# EAGLE board A20-OLinuXino-Lime2_Rev_C (EAGLE 6.6.0), part 1 of 5
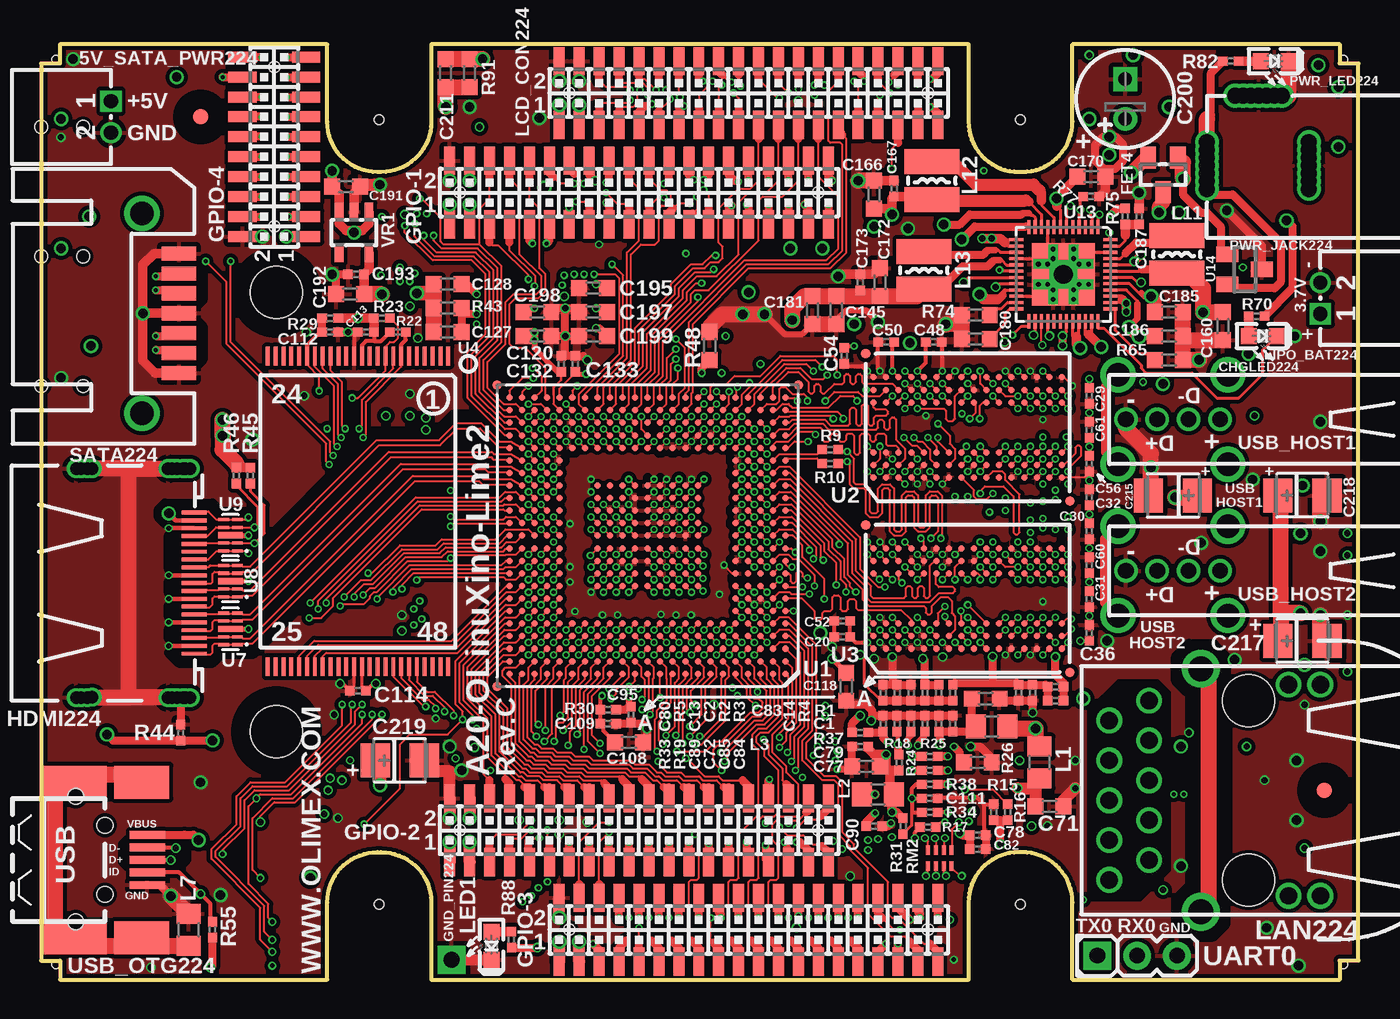
[diagram p5: board, top side]
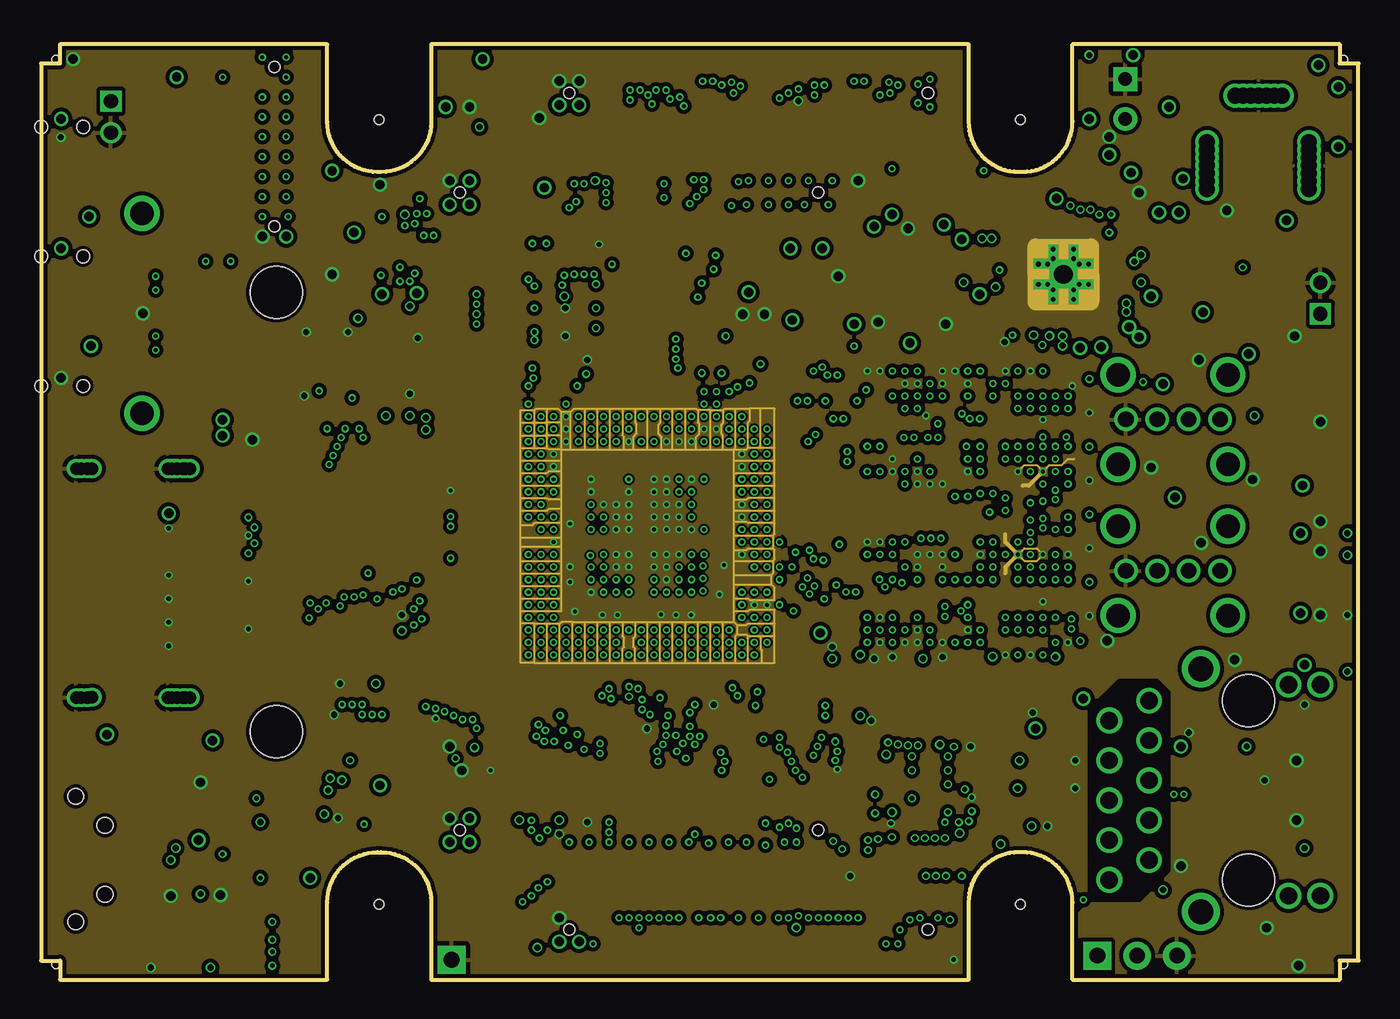
[diagram p6: board, inner layer GND]
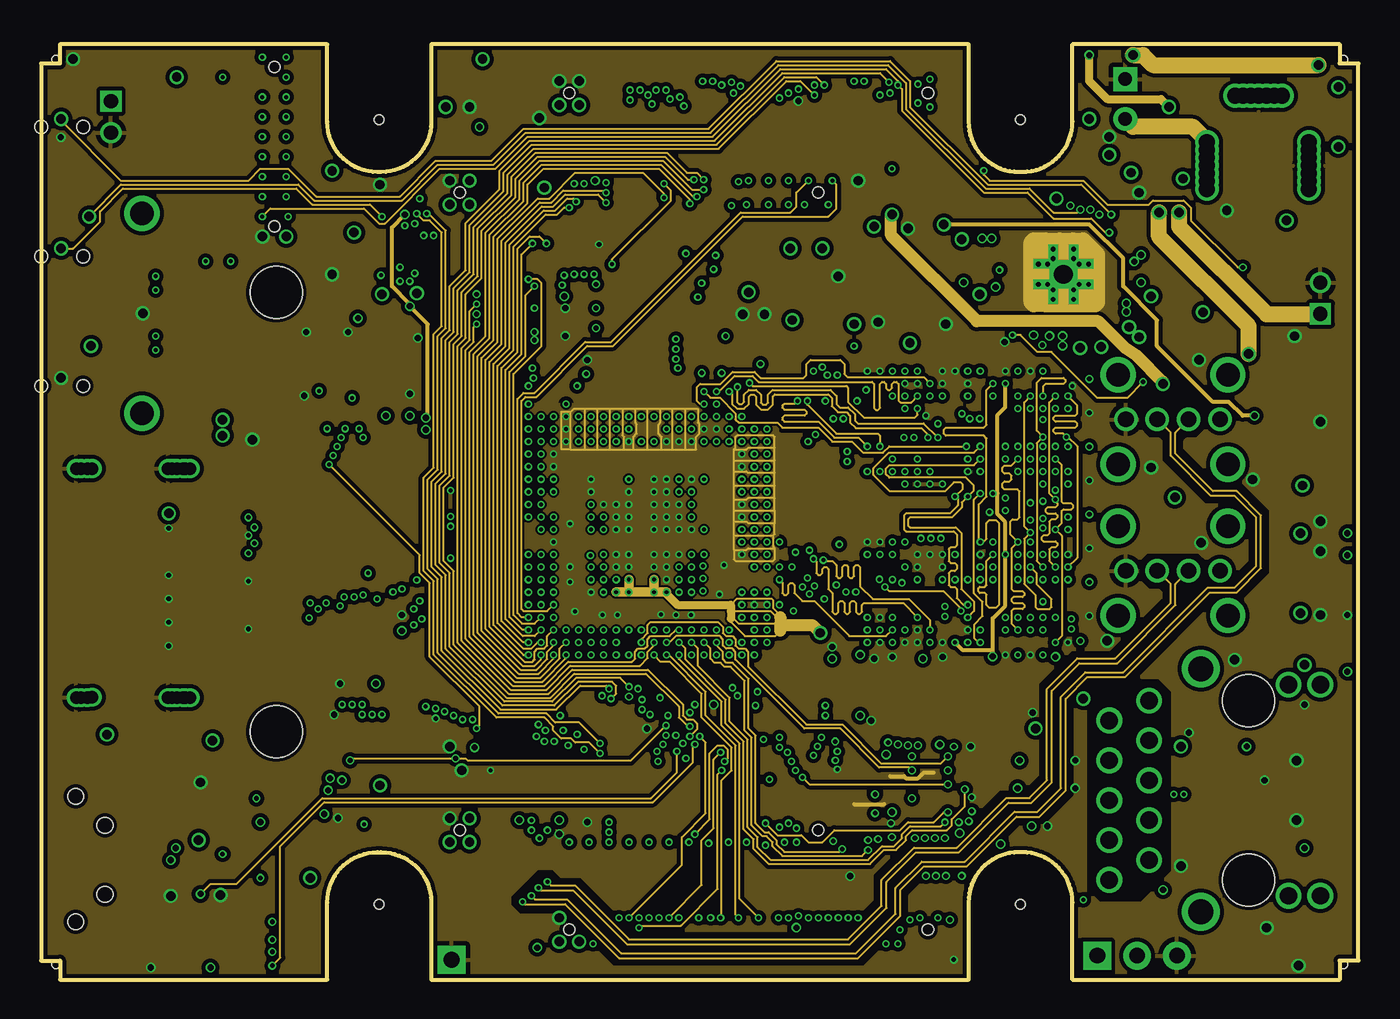
[diagram p7: board, inner layer Route3]
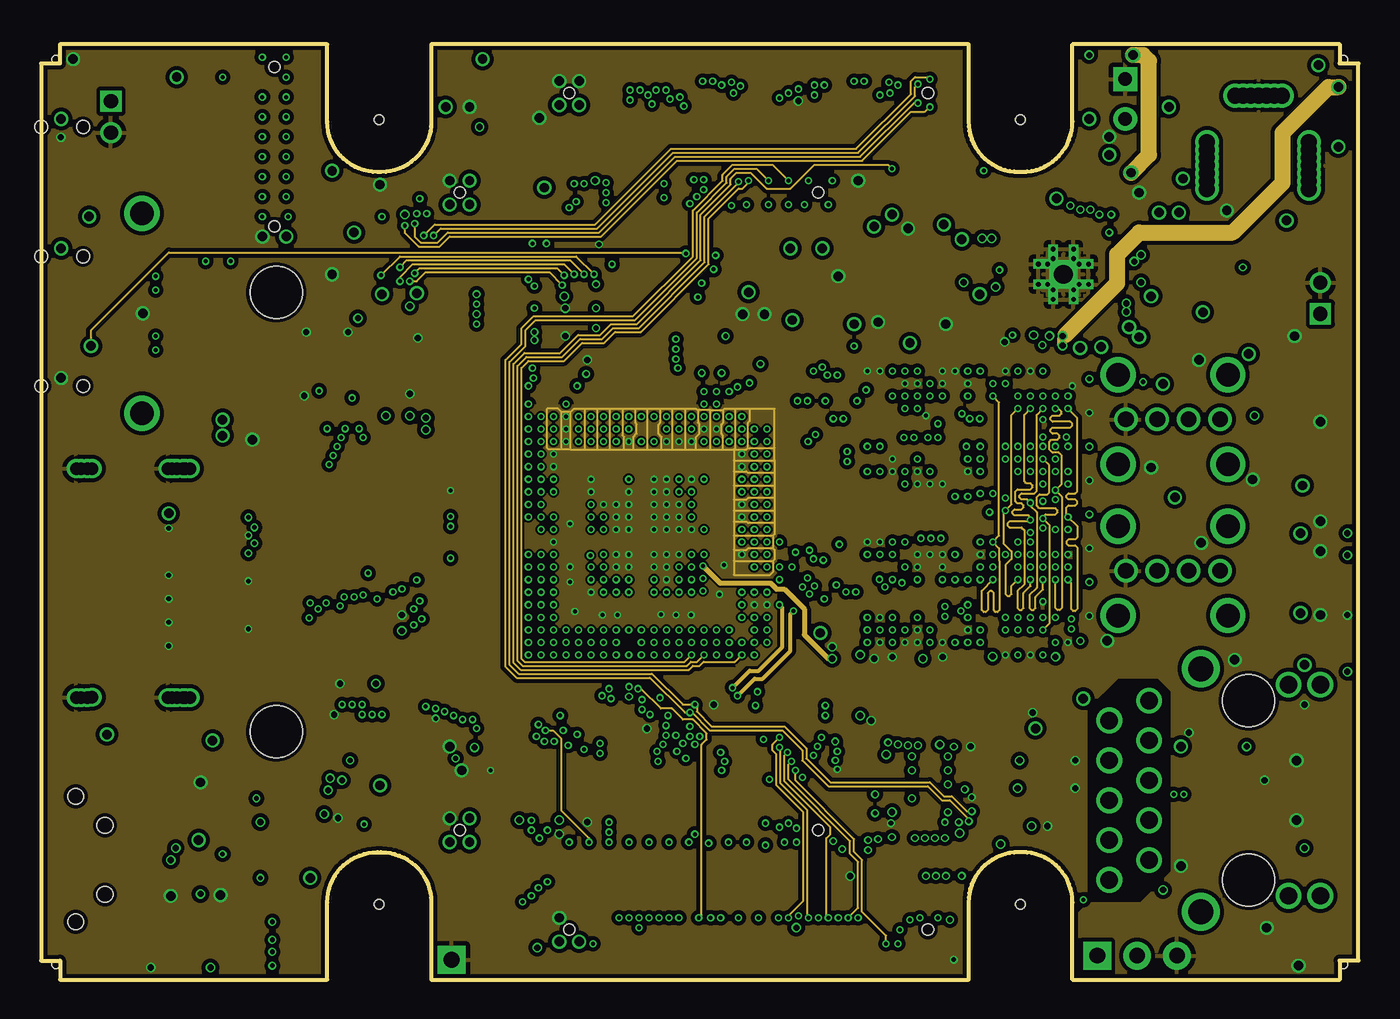
[diagram p8: board, inner layer Route4]
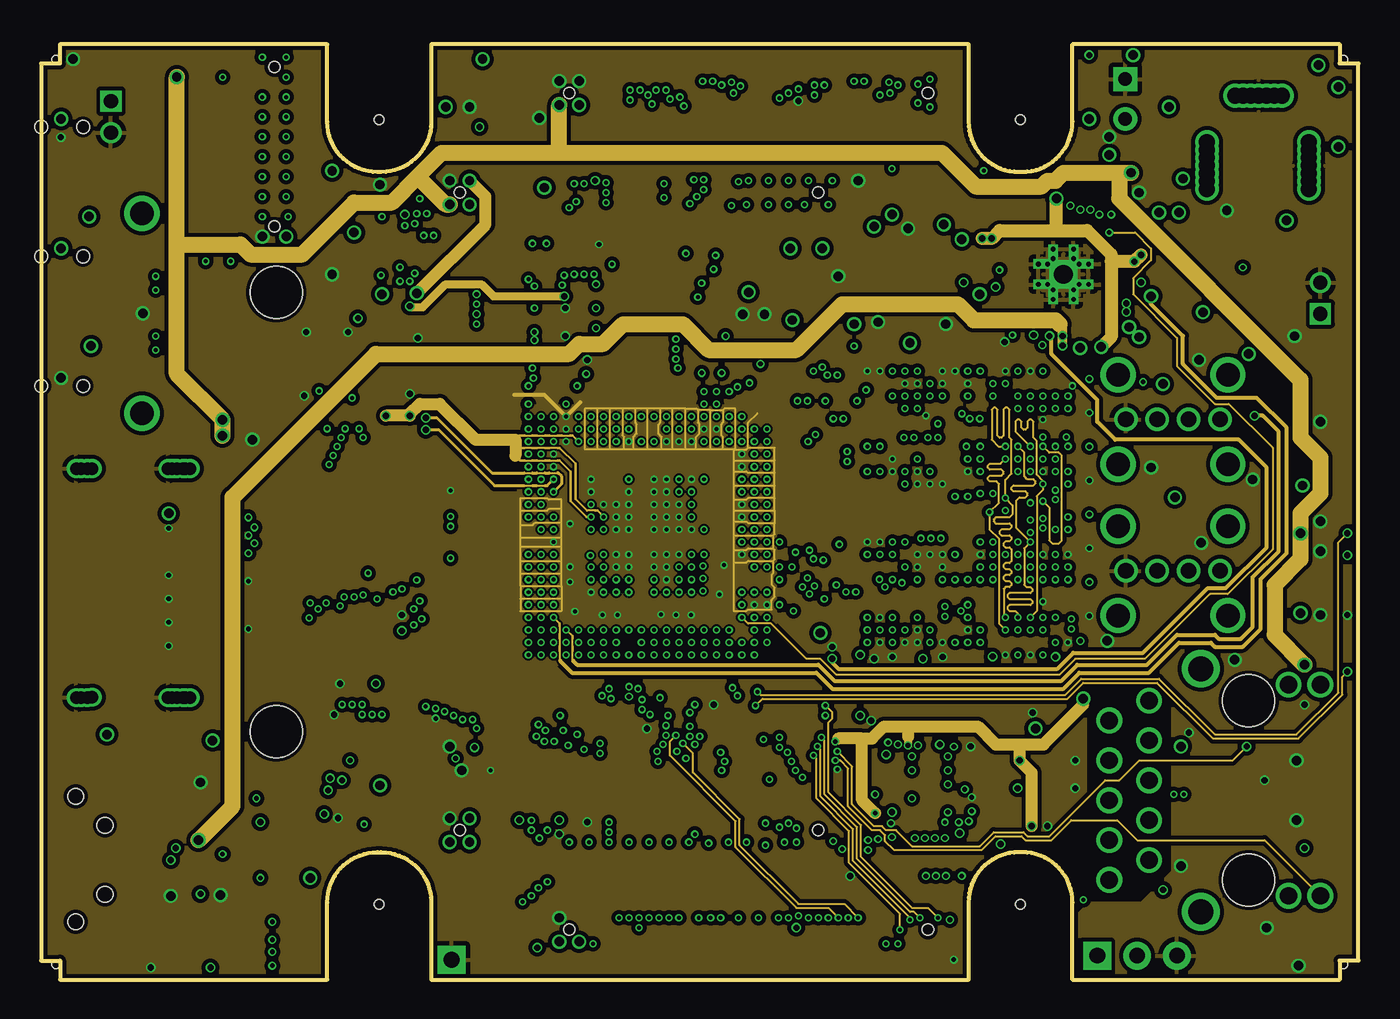
[diagram p9: board, inner layer Route13]
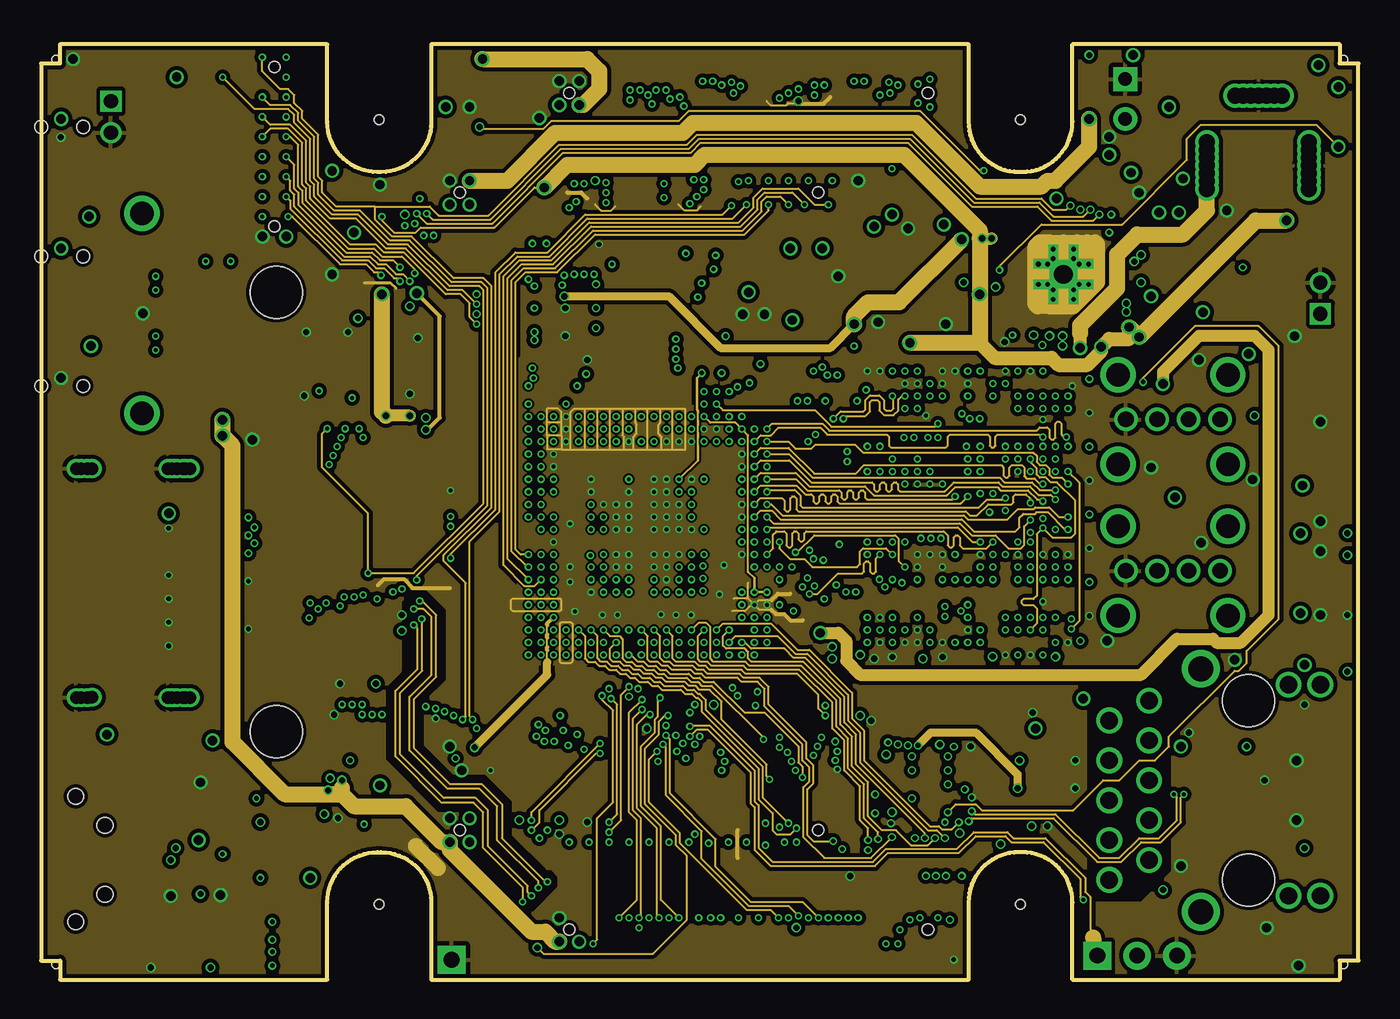
[diagram p10: board, inner layer Route14]
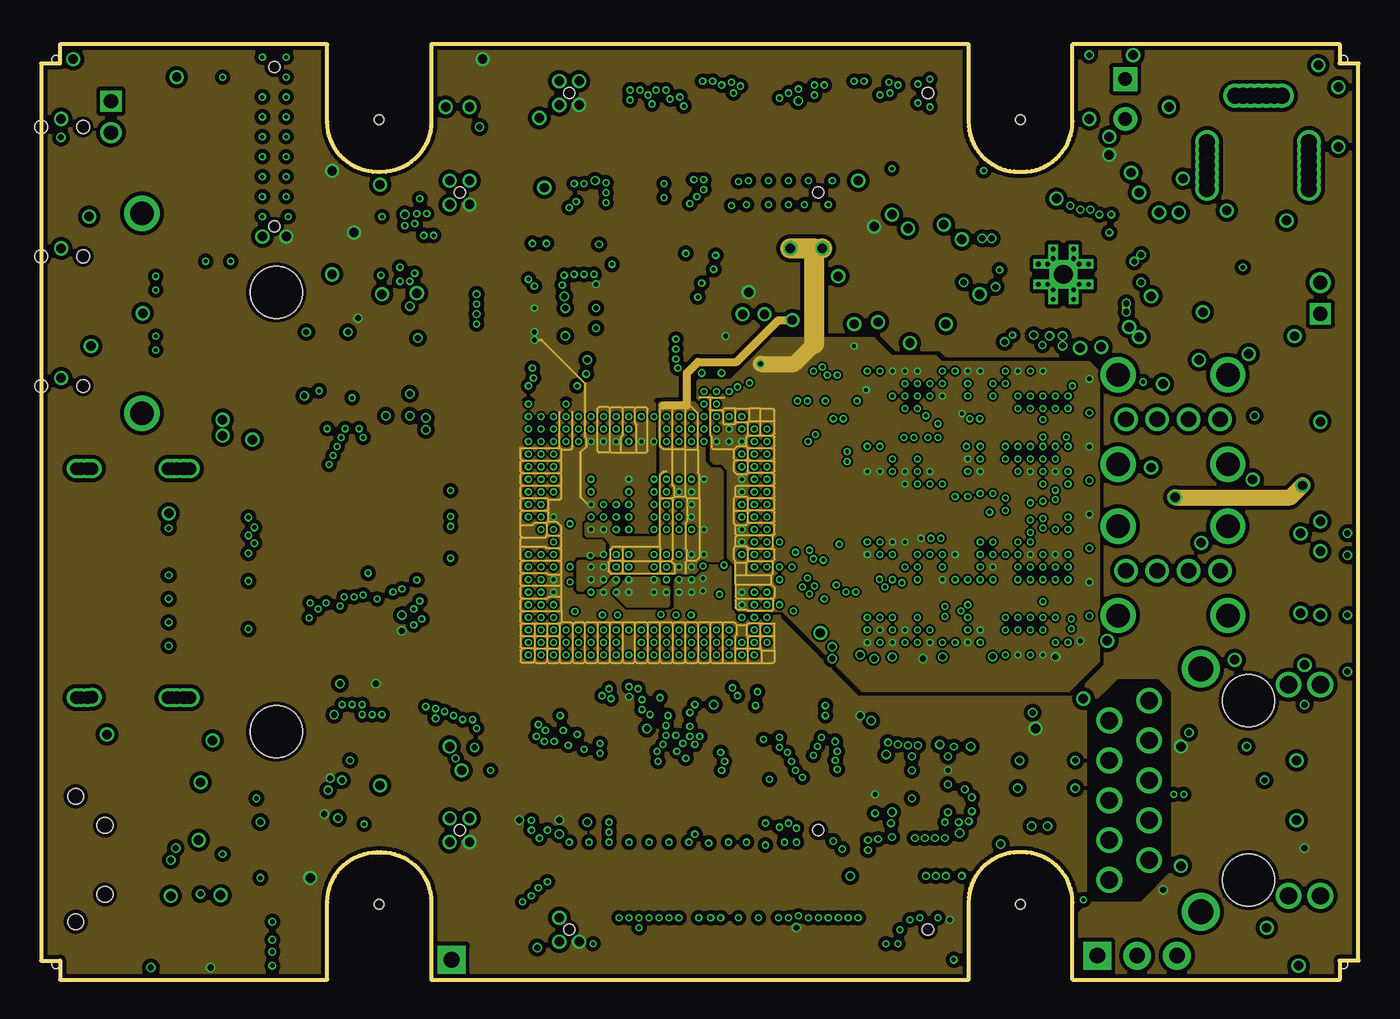
[diagram p11: board, inner layer PWR]
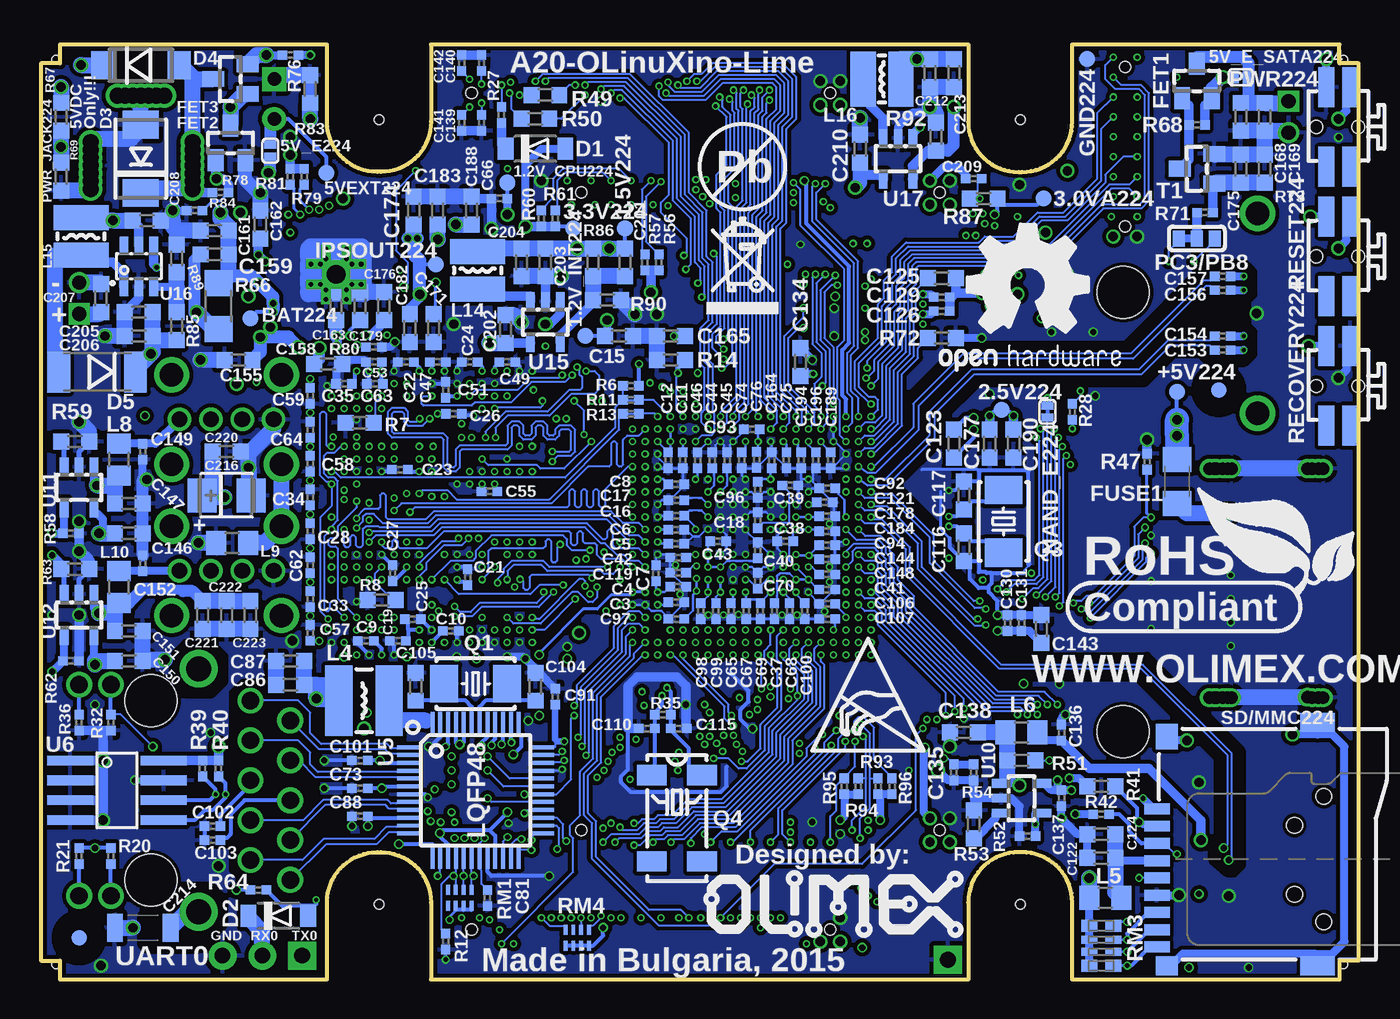
[diagram p12: board, bottom side, seen from below]

Size 83.96 x 59.61 mm. Coordinates in mm from the lower left corner, seen from the top.
Copper layers (1*2*3*4*13*14*15*16): Top 0.035mm / dielectric 4mil / GND 0.035mm / dielectric 0.3mm / Route3 0.035mm / dielectric 4mil / Route4 0.035mm / dielectric 0.3mm / Route13 0.035mm / dielectric 4mil / Route14 0.035mm / dielectric 0.3mm / PWR 0.035mm / dielectric 4mil / Bottom 0.035mm
Design rules "default": minimum track width 4.5mil, minimum drill 10mil, track to track 5mil, track to pad 5mil, pad to pad 5mil, via to via 5mil, smd to smd 1mil, copper to edge 10mil, drill to drill 8mil, minimum pad ring 6mil, minimum via ring 4mil, stop-mask expansion 4mil, vias tented up to drill 25mil, thermal gap 12mil
Net classes: 2 lan_sh: clearance 0.762 mm
tRestrict: 152 lines
bRestrict: 77 lines

## Footprints (pad centres in the part's own frame; a part is rotated, then mirrored left to right if it is on the bottom)
TESTPAD_40-ROUND = smd 1.016 x 1.016: 1 0,0
SJ_1_SMALLER = smd 0.508 x 0.762: 1 -0.381,0; 2 0.381,0
DW02R = drill 0.9 square: 1 -1,0 | drill 0.9: 2 1,0
C0402_TI = smd 0.61 x 0.584: 1 -0.508,0; 2 0.508,0
C0603_DWS = smd 1.016 x 1.016: 1 -0.889,0; 2 0.889,0
E2,5-6,3 = drill 0.864 pad 1.524: + -1.27,0 | drill 0.864 pad 1.524 square: - 1.27,0
C1206_5MILS_WS_ISO = smd 1.016 x 1.778: 1 -1.778,0; 2 1.778,0
CT3528_MIL = smd 1.854 x 2.184: + 1.562,0; - -1.562,0
LED-0603 = smd 1.016 x 1.016: A 0.889,0; C -0.889,0
SOD-123 = smd 1 x 1.4: A 1.9,0; C -1.9,0
DO214AA = smd 1.778 x 2.286: A 2.177,0; C -2.177,0
MLL-41 = smd 1.45 x 1.8: A 2.445,0; K -2.445,0
MELF-MLL41 = smd 1.45 x 2.6: 1 -2.445,0; 2 2.445,0
SOT23 = smd 1.4 x 1: 1 1.1,-0.95; 2 1.1,0.95; 3 -1.1,0
1206 = smd 1.6 x 1.8: 1 -1.4,0; 2 1.4,0
TEST_PAD40/70/SQUARE = drill 1.016 pad 1.778 square: P$1 0,0
GPH127SMT-02X20(PA-V16X-2X20-LF) = smd 0.7 x 1.8: 1 -12.065,-2.032; 2 -12.065,2.032; 3 -10.795,-2.032; 4 -10.795,2.032; 5 -9.525,-2.032; 6 -9.525,2.032; 7 -8.255,-2.032; 8 -8.255,2.032; 9 -6.985,-2.032; 10 -6.985,2.032; 11 -5.715,-2.032; 12 -5.715,2.032; 13 -4.445,-2.032; 14 -4.445,2.032; 15 -3.175,-2.032; 16 -3.175,2.032; 17 -1.905,-2.032; 18 -1.905,2.032; 19 -0.635,-2.032; 20 -0.635,2.032; 21 0.635,-2.032; 22 0.635,2.032; 23 1.905,-2.032; 24 1.905,2.032; 25 3.175,-2.032; 26 3.175,2.032; 27 4.445,-2.032; 28 4.445,2.032; 29 5.715,-2.032; 30 5.715,2.032; 31 6.985,-2.032; 32 6.985,2.032; 33 8.255,-2.032; 34 8.255,2.032; 35 9.525,-2.032; 36 9.525,2.032; 37 10.795,-2.032; 38 10.795,2.032; 39 12.065,-2.032; 40 12.065,2.032 | hole 0.7: -11.43,0; 11.43,0
GPH127SMT-02X10(PA-V16X-2X10-LF) = smd 0.7 x 1.8: 1 -5.715,-2.032; 2 -5.715,2.032; 3 -4.445,-2.032; 4 -4.445,2.032; 5 -3.175,-2.032; 6 -3.175,2.032; 7 -1.905,-2.032; 8 -1.905,2.032; 9 -0.635,-2.032; 10 -0.635,2.032; 11 0.635,-2.032; 12 0.635,2.032; 13 1.905,-2.032; 14 1.905,2.032; 15 3.175,-2.032; 16 3.175,2.032; 17 4.445,-2.032; 18 4.445,2.032; 19 5.715,-2.032; 20 5.715,2.032 | hole 0.7: -5.08,0; 5.08,0
HDMI-SWM-19 = smd 0.25 x 1.6: 1 -4.5,-5.55; 2 -4,-5.55; 3 -3.5,-5.55; 4 -3,-5.55; 5 -2.5,-5.55; 6 -2,-5.55; 7 -1.5,-5.55; 8 -1,-5.55; 9 -0.5,-5.55; 10 0,-5.55; 11 0.5,-5.55; 12 1,-5.55; 13 1.5,-5.55; 14 2,-5.55; 15 2.5,-5.55; 16 3,-5.55; 17 3.5,-5.55; 18 4,-5.55; 19 4.5,-5.55 | drill 0.8: P$5 -7.3,-4.85; P$7 -7.3,1.25; P$9 7.3,1.25; P$11 7.3,-4.85; P$13 -7.3,-4.45; P$15 -7.3,1.65; P$18 7.3,1.65; P$20 7.3,-4.45; P$21 -7.3,-4.15; P$22 -7.3,-5; P$23 7.3,-5; P$24 7.3,-4.15; P$25 -7.3,-5.3; P$26 7.3,-5.3; P$27 7.3,0.95; P$28 -7.275,0.95; SH1 -7.3,-3.9; SH2 -7.3,1.95; SH3 7.3,1.95; SH4 7.3,-3.9
L0805_5MIL_DWS = smd 1.27 x 1.524: 1 -1.016,0; 2 1.016,0
CD42(43) = smd 1.75 x 4.5: 1 -1.6,0; 2 1.6,0
CD32 = smd 1.6 x 3.5: 1 -1.2,0; 2 1.2,0
TM211Q01FM22_SH = drill 1.1: 1 -5.715,-6.35; 2 -4.445,-8.89; 3 -3.175,-6.35; 4 -1.905,-8.89; 5 -0.635,-6.35; 6 0.635,-8.89; 7 1.905,-6.35; 8 3.175,-8.89; 9 4.445,-6.35; 10 5.715,-8.89; 11 -6.731,2.54; 12 -6.731,4.572; 13 6.731,2.54; 14 6.731,4.572 | drill 1.6: SH1 -7.747,-3.048; SH2 7.747,-3.048 | hole 3.3: 5.715,0; -5.715,0
SJ_1_SMALLER_CLOSE_10MILS = smd 0.508 x 0.762: 1 -0.381,0; 2 0.381,0
SJ_2_SMALL_23_TIED = smd 0.762 x 1.016: 1 -1.143,0; 2 0,0; 3 1.143,0
SW_TAKT3X4 = smd 2.54 x 1.016: 1_1 -2.54,0.762; 1_2 2.54,0.762; 2_1 -2.54,-0.762; 2_2 2.54,-0.762 | hole 0.8: 0,-1.397; 0,1.27
PWR_JACK_UNI_MILLING = drill 1: + 0,4.75; +1 0,5.25; +2 0,5.75; +3 0,6.25; +4 0,4.25; +5 0,3.75; +6 0,3.25; - -6.5,4.75; -1 -6.5,5.25; -2 -6.5,5.75; -3 -6.5,4.25; -4 -6.5,3.75; -5 -6.5,6.25; -6 -6.5,3.25; -- -3.3,0.3; --1 -3.8,0.3; --2 -4.3,0.3; --3 -4.8,0.3; --4 -2.8,0.3; --5 -2.3,0.3; --6 -1.8,0.3
HCX-4S = smd 1.8 x 2.4: 1 -2,0; 2 2,0
MC-306 = smd 1.3 x 1.9: 1 -2.75,-1.6; 2 2.75,-1.6; 3 2.75,1.6; 4 -2.75,1.6
R0402_TI = smd 0.61 x 0.584: 1 -0.508,0; 2 0.508,0
R0603_5MIL_DWS = smd 1.016 x 1.016: 1 -0.889,0; 2 0.889,0
R0402_TI_0R = smd 0.61 x 0.584: 1 -0.508,0; 2 0.508,0
R1206_5MIL_WS = smd 1.651 x 1.778: 1 -1.46,0; 2 1.46,0
0603_0R = smd 1.016 x 1.016: 1 -0.889,0; 2 0.889,0
R_MATRIX_4_0402_25X625 = smd 0.25 x 0.625: 1.1 -0.75,-0.512; 1.2 -0.75,0.512; 2.1 -0.25,-0.512; 2.2 -0.25,0.512; 3.1 0.25,-0.512; 3.2 0.25,0.512; 4.1 0.75,-0.512; 4.2 0.75,0.512
R_MATRIX_4 = smd 0.762 x 1.016: 1.1 -1.27,-0.762; 1.2 -1.27,0.762; 4.1 1.27,-0.762; 4.2 1.27,0.762 | smd 0.508 x 1.016: 2.1 -0.381,-0.762; 2.2 -0.381,0.762; 3.1 0.381,-0.762; 3.2 0.381,0.762
SATA-PWA-07 = smd 0.9 x 2.2: 1 -4.25,-4.8; 2 -2.98,-4.8; 3 -1.71,-4.8; 4 -0.44,-4.8; 5 0.83,-4.8; 6 2.1,-4.8; 7 3.37,-4.8 | drill 1.5: P$8 -6.81,-2.44; P$9 5.93,-2.44
TFC-WPAPR-08 = smd 1.6 x 0.7: 1 -7.375,2.25; 2 -7.375,1.15; 3 -7.375,0.05; 4 -7.375,-1.05; 5 -7.375,-2.15; 6 -7.375,-3.25; 7 -7.375,-4.35; 8 -7.375,-5.45; 9 -7.375,-6.55 | smd 1.4 x 1.2: 10 -6.75,-7.75 | smd 1.4 x 1.6: 11 -6.75,6.85 | smd 2.2 x 1.2: 12 2.85,-7.75; 13 2.85,7.75 | hole 1: 3.25,-4.95; 3.25,3.05
TFBGA441 = smd 0.4 x 0.4: A1 -8.8,-8.8; A2 -8.8,-8; A3 -8.8,-7.2; A4 -8.8,-6.4; A5 -8.8,-5.6; A6 -8.8,-4.8; A7 -8.8,-4; A8 -8.8,-3.2; A9 -8.8,-2.4; A10 -8.8,-1.6; A11 -8.8,-0.8; A12 -8.8,0; A13 -8.8,0.8; A14 -8.8,1.6; A15 -8.8,2.4; A16 -8.8,3.2; A17 -8.8,4; A18 -8.8,4.8; A19 -8.8,5.6; A20 -8.8,6.4; A21 -8.8,7.2; A22 -8.8,8; A23 -8.8,8.8; AA1 7.2,-8.8; AA2 7.2,-8; AA3 7.2,-7.2; AA4 7.2,-6.4; AA5 7.2,-5.6; AA6 7.2,-4.8; AA7 7.2,-4; AA8 7.2,-3.2; AA9 7.2,-2.4; AA10 7.2,-1.6; AA11 7.2,-0.8; AA12 7.2,0; AA13 7.2,0.8; AA14 7.2,1.6; AA15 7.2,2.4; AA16 7.2,3.2; AA17 7.2,4; AA18 7.2,4.8; AA19 7.2,5.6; AA20 7.2,6.4; AA21 7.2,7.2; AA22 7.2,8; AA23 7.2,8.8; AB1 8,-8.8; AB2 8,-8; AB3 8,-7.2; AB4 8,-6.4; AB5 8,-5.6; AB6 8,-4.8; AB7 8,-4; AB8 8,-3.2; AB9 8,-2.4; AB10 8,-1.6; AB11 8,-0.8; AB12 8,0; AB13 8,0.8; AB14 8,1.6; AB15 8,2.4; AB16 8,3.2; AB17 8,4; AB18 8,4.8; AB19 8,5.6; AB20 8,6.4; AB21 8,7.2; AB22 8,8; AB23 8,8.8; AC1 8.8,-8.8; AC2 8.8,-8; AC3 8.8,-7.2; AC4 8.8,-6.4; AC5 8.8,-5.6; AC6 8.8,-4.8; AC7 8.8,-4; AC8 8.8,-3.2; AC9 8.8,-2.4; AC10 8.8,-1.6; AC11 8.8,-0.8; AC12 8.8,0; AC13 8.8,0.8; AC14 8.8,1.6; AC15 8.8,2.4; AC16 8.8,3.2; AC17 8.8,4; AC18 8.8,4.8; AC19 8.8,5.6; AC20 8.8,6.4; AC21 8.8,7.2; AC22 8.8,8; AC23 8.8,8.8; B1 -8,-8.8; B2 -8,-8; B3 -8,-7.2; B4 -8,-6.4; B5 -8,-5.6; B6 -8,-4.8; B7 -8,-4; B8 -8,-3.2; B9 -8,-2.4; B10 -8,-1.6; B11 -8,-0.8; B12 -8,0; B13 -8,0.8; B14 -8,1.6; B15 -8,2.4; B16 -8,3.2; B17 -8,4; B18 -8,4.8; B19 -8,5.6; B20 -8,6.4; B21 -8,7.2; B22 -8,8; B23 -8,8.8; C1 -7.2,-8.8; C2 -7.2,-8; C3 -7.2,-7.2; C4 -7.2,-6.4; C5 -7.2,-5.6; C6 -7.2,-4.8; C7 -7.2,-4; C8 -7.2,-3.2; C9 -7.2,-2.4; C10 -7.2,-1.6; C11 -7.2,-0.8; C12 -7.2,0; C13 -7.2,0.8; C14 -7.2,1.6; C15 -7.2,2.4; C16 -7.2,3.2; C17 -7.2,4; C18 -7.2,4.8; C19 -7.2,5.6; C20 -7.2,6.4; C21 -7.2,7.2; C22 -7.2,8; C23 -7.2,8.8; D1 -6.4,-8.8; D2 -6.4,-8; D3 -6.4,-7.2; D4 -6.4,-6.4; D5 -6.4,-5.6; D6 -6.4,-4.8; D7 -6.4,-4; D8 -6.4,-3.2; D9 -6.4,-2.4; D10 -6.4,-1.6; D11 -6.4,-0.8; D12 -6.4,0; D13 -6.4,0.8; D14 -6.4,1.6; D15 -6.4,2.4; D16 -6.4,3.2; D17 -6.4,4; D18 -6.4,4.8; D19 -6.4,5.6; D20 -6.4,6.4; D21 -6.4,7.2; D22 -6.4,8; D23 -6.4,8.8; E1 -5.6,-8.8; E2 -5.6,-8; E3 -5.6,-7.2; E4 -5.6,-6.4; E5 -5.6,-5.6; E6 -5.6,-4.8; E7 -5.6,-4; E8 -5.6,-3.2; E9 -5.6,-2.4; E10 -5.6,-1.6; E11 -5.6,-0.8; E12 -5.6,0; E13 -5.6,0.8; E14 -5.6,1.6; E15 -5.6,2.4; E16 -5.6,3.2; E17 -5.6,4; E18 -5.6,4.8; E19 -5.6,5.6; E20 -5.6,6.4; E21 -5.6,7.2; E22 -5.6,8; E23 -5.6,8.8; F1 -4.8,-8.8; F2 -4.8,-8; F3 -4.8,-7.2; F4 -4.8,-6.4; F5 -4.8,-5.6; F19 -4.8,5.6; F20 -4.8,6.4; F21 -4.8,7.2; F22 -4.8,8; F23 -4.8,8.8; G1 -4,-8.8; G2 -4,-8; G3 -4,-7.2; G4 -4,-6.4; G5 -4,-5.6; G19 -4,5.6; G20 -4,6.4; G21 -4,7.2; G22 -4,8; G23 -4,8.8; H1 -3.2,-8.8; H2 -3.2,-8; H3 -3.2,-7.2; H4 -3.2,-6.4; H5 -3.2,-5.6; H8 -3.2,-3.2; H9 -3.2,-2.4; H10 -3.2,-1.6; H11 -3.2,-0.8; H12 -3.2,0; H13 -3.2,0.8; H14 -3.2,1.6; H15 -3.2,2.4; H16 -3.2,3.2; H19 -3.2,5.6; H20 -3.2,6.4; H21 -3.2,7.2; H22 -3.2,8; H23 -3.2,8.8; J1 -2.4,-8.8; J2 -2.4,-8; J3 -2.4,-7.2; J4 -2.4,-6.4; J5 -2.4,-5.6; J8 -2.4,-3.2; J9 -2.4,-2.4; J10 -2.4,-1.6; J11 -2.4,-0.8; J12 -2.4,0; J13 -2.4,0.8; J14 -2.4,1.6; J15 -2.4,2.4; J16 -2.4,3.2; J19 -2.4,5.6; J20 -2.4,6.4; J21 -2.4,7.2; J22 -2.4,8; J23 -2.4,8.8; K1 -1.6,-8.8; K2 -1.6,-8; K3 -1.6,-7.2; K4 -1.6,-6.4; K5 -1.6,-5.6; K8 -1.6,-3.2; K9 -1.6,-2.4; K10 -1.6,-1.6; K11 -1.6,-0.8; K12 -1.6,0; K13 -1.6,0.8; K14 -1.6,1.6; K15 -1.6,2.4; K16 -1.6,3.2; K19 -1.6,5.6; K20 -1.6,6.4; K21 -1.6,7.2; K22 -1.6,8; K23 -1.6,8.8; L1 -0.8,-8.8; L2 -0.8,-8; L3 -0.8,-7.2; L4 -0.8,-6.4; L5 -0.8,-5.6; L8 -0.8,-3.2; L9 -0.8,-2.4; L10 -0.8,-1.6; L11 -0.8,-0.8; L12 -0.8,0; L13 -0.8,0.8; L14 -0.8,1.6; L15 -0.8,2.4; L16 -0.8,3.2; L19 -0.8,5.6; L20 -0.8,6.4; L21 -0.8,7.2; L22 -0.8,8; L23 -0.8,8.8; M1 0,-8.8; M2 0,-8; M3 0,-7.2; M4 0,-6.4; M5 0,-5.6; M8 0,-3.2; M9 0,-2.4; M10 0,-1.6; M11 0,-0.8; M12 0,0; M13 0,0.8; M14 0,1.6; M15 0,2.4; M16 0,3.2; M19 0,5.6; M20 0,6.4; M21 0,7.2; M22 0,8; M23 0,8.8; N1 0.8,-8.8; N2 0.8,-8; N3 0.8,-7.2; N4 0.8,-6.4; N5 0.8,-5.6; N8 0.8,-3.2; N9 0.8,-2.4; N10 0.8,-1.6; N11 0.8,-0.8; N12 0.8,0; N13 0.8,0.8; N14 0.8,1.6; N15 0.8,2.4; N16 0.8,3.2; N19 0.8,5.6; N20 0.8,6.4; N21 0.8,7.2; N22 0.8,8; N23 0.8,8.8; P1 1.6,-8.8; P2 1.6,-8; P3 1.6,-7.2; P4 1.6,-6.4; P5 1.6,-5.6; P8 1.6,-3.2; P9 1.6,-2.4; P10 1.6,-1.6; P11 1.6,-0.8; P12 1.6,0; P13 1.6,0.8; P14 1.6,1.6; P15 1.6,2.4; P16 1.6,3.2; P19 1.6,5.6; P20 1.6,6.4; P21 1.6,7.2; P22 1.6,8; P23 1.6,8.8; R1 2.4,-8.8; R2 2.4,-8; R3 2.4,-7.2; R4 2.4,-6.4; R5 2.4,-5.6; R8 2.4,-3.2; R9 2.4,-2.4; R10 2.4,-1.6; R11 2.4,-0.8; R12 2.4,0; R13 2.4,0.8; R14 2.4,1.6; R15 2.4,2.4; R16 2.4,3.2; R19 2.4,5.6; R20 2.4,6.4; R21 2.4,7.2; R22 2.4,8; R23 2.4,8.8; T1 3.2,-8.8; T2 3.2,-8; T3 3.2,-7.2; T4 3.2,-6.4; T5 3.2,-5.6; T8 3.2,-3.2; T9 3.2,-2.4; T10 3.2,-1.6; T11 3.2,-0.8; T12 3.2,0; T13 3.2,0.8; T14 3.2,1.6; T15 3.2,2.4; T16 3.2,3.2; T19 3.2,5.6; T20 3.2,6.4; T21 3.2,7.2; T22 3.2,8; T23 3.2,8.8; U1 4,-8.8; U2 4,-8; U3 4,-7.2; U4 4,-6.4; U5 4,-5.6; U19 4,5.6; U20 4,6.4; U21 4,7.2; U22 4,8; U23 4,8.8; V1 4.8,-8.8; V2 4.8,-8; V3 4.8,-7.2; V4 4.8,-6.4; V5 4.8,-5.6; V19 4.8,5.6; V20 4.8,6.4; V21 4.8,7.2; V22 4.8,8; V23 4.8,8.8; W1 5.6,-8.8; W2 5.6,-8; W3 5.6,-7.2; W4 5.6,-6.4; W5 5.6,-5.6; W6 5.6,-4.8; W7 5.6,-4; W8 5.6,-3.2; W9 5.6,-2.4; W10 5.6,-1.6; W11 5.6,-0.8; W12 5.6,0; W13 5.6,0.8; W14 5.6,1.6; W15 5.6,2.4; W16 5.6,3.2; W17 5.6,4; W18 5.6,4.8; W19 5.6,5.6; W20 5.6,6.4; W21 5.6,7.2; W22 5.6,8; W23 5.6,8.8; Y1 6.4,-8.8; Y2 6.4,-8; Y3 6.4,-7.2; Y4 6.4,-6.4; Y5 6.4,-5.6; Y6 6.4,-4.8; Y7 6.4,-4; Y8 6.4,-3.2; Y9 6.4,-2.4; Y10 6.4,-1.6; Y11 6.4,-0.8; Y12 6.4,0; Y13 6.4,0.8; Y14 6.4,1.6; Y15 6.4,2.4; Y16 6.4,3.2; Y17 6.4,4; Y18 6.4,4.8; Y19 6.4,5.6; Y20 6.4,6.4; Y21 6.4,7.2; Y22 6.4,8; Y23 6.4,8.8 | smd 0.6 x 0.6: FID1 -9.6,9.6; FID2 9.6,9.6; FID3 9.6,-9.6
FBGA96_SK = smd 0.4 x 0.4: A1 -6,-3.2; A2 -6,-2.4; A3 -6,-1.6; A7 -6,1.6; A8 -6,2.4; A9 -6,3.2; B1 -5.2,-3.2; B2 -5.2,-2.4; B3 -5.2,-1.6; B7 -5.2,1.6; B8 -5.2,2.4; B9 -5.2,3.2; C1 -4.4,-3.2; C2 -4.4,-2.4; C3 -4.4,-1.6; C7 -4.4,1.6; C8 -4.4,2.4; C9 -4.4,3.2; D1 -3.6,-3.2; D2 -3.6,-2.4; D3 -3.6,-1.6; D7 -3.6,1.6; D8 -3.6,2.4; D9 -3.6,3.2; E1 -2.8,-3.2; E2 -2.8,-2.4; E3 -2.8,-1.6; E7 -2.8,1.6; E8 -2.8,2.4; E9 -2.8,3.2; F1 -2,-3.2; F2 -2,-2.4; F3 -2,-1.6; F7 -2,1.6; F8 -2,2.4; F9 -2,3.2; G1 -1.2,-3.2; G2 -1.2,-2.4; G3 -1.2,-1.6; G7 -1.2,1.6; G8 -1.2,2.4; G9 -1.2,3.2; H1 -0.4,-3.2; H2 -0.4,-2.4; H3 -0.4,-1.6; H7 -0.4,1.6; H8 -0.4,2.4; H9 -0.4,3.2; J1 0.4,-3.2; J2 0.4,-2.4; J3 0.4,-1.6; J7 0.4,1.6; J8 0.4,2.4; J9 0.4,3.2; K1 1.2,-3.2; K2 1.2,-2.4; K3 1.2,-1.6; K7 1.2,1.6; K8 1.2,2.4; K9 1.2,3.2; L1 2,-3.2; L2 2,-2.4; L3 2,-1.6; L7 2,1.6; L8 2,2.4; L9 2,3.2; M1 2.8,-3.2; M2 2.8,-2.4; M3 2.8,-1.6; M7 2.8,1.6; M8 2.8,2.4; M9 2.8,3.2; N1 3.6,-3.2; N2 3.6,-2.4; N3 3.6,-1.6; N7 3.6,1.6; N8 3.6,2.4; N9 3.6,3.2; P1 4.4,-3.2; P2 4.4,-2.4; P3 4.4,-1.6; P7 4.4,1.6; P8 4.4,2.4; P9 4.4,3.2; R1 5.2,-3.2; R2 5.2,-2.4; R3 5.2,-1.6; R7 5.2,1.6; R8 5.2,2.4; R9 5.2,3.2; T1 6,-3.2; T2 6,-2.4; T3 6,-1.6; T7 6,1.6; T8 6,2.4; T9 6,3.2 | smd 0.6 x 0.6: FID1 6.5,-4.7; FID2 -6.5,4.7
TSOP48 = smd 1.2 x 0.25: 1 -9.9,5.75; 2 -9.9,5.25; 3 -9.9,4.75; 4 -9.9,4.25; 5 -9.9,3.75; 6 -9.9,3.25; 7 -9.9,2.75; 8 -9.9,2.25; 9 -9.9,1.75; 10 -9.9,1.25; 11 -9.9,0.75; 12 -9.9,0.25; 13 -9.9,-0.25; 14 -9.9,-0.75; 15 -9.9,-1.25; 16 -9.9,-1.75; 17 -9.9,-2.25; 18 -9.9,-2.75; 19 -9.9,-3.25; 20 -9.9,-3.75; 21 -9.9,-4.25; 22 -9.9,-4.75; 23 -9.9,-5.25; 24 -9.9,-5.75; 25 9.9,-5.75; 26 9.9,-5.25; 27 9.9,-4.75; 28 9.9,-4.25; 29 9.9,-3.75; 30 9.9,-3.25; 31 9.9,-2.75; 32 9.9,-2.25; 33 9.9,-1.75; 34 9.9,-1.25; 35 9.9,-0.75; 36 9.9,-0.25; 37 9.9,0.25; 38 9.9,0.75; 39 9.9,1.25; 40 9.9,1.75; 41 9.9,2.25; 42 9.9,2.75; 43 9.9,3.25; 44 9.9,3.75; 45 9.9,4.25; 46 9.9,4.75; 47 9.9,5.25; 48 9.9,5.75
LQFP48 = smd 0.254 x 1.4: 1 -2.75,-4.3; 2 -2.25,-4.3; 3 -1.75,-4.3; 4 -1.25,-4.3; 5 -0.75,-4.3; 6 -0.25,-4.3; 7 0.25,-4.3; 8 0.75,-4.3; 9 1.25,-4.3; 10 1.75,-4.3; 11 2.25,-4.3; 12 2.75,-4.3; 25 2.75,4.3; 26 2.25,4.3; 27 1.75,4.3; 28 1.25,4.3; 29 0.75,4.3; 30 0.25,4.3; 31 -0.25,4.3; 32 -0.75,4.3; 33 -1.25,4.3; 34 -1.75,4.3; 35 -2.25,4.3; 36 -2.75,4.3 | smd 1.4 x 0.254: 13 4.3,-2.75; 14 4.3,-2.25; 15 4.3,-1.75; 16 4.3,-1.25; 17 4.3,-0.75; 18 4.3,-0.25; 19 4.3,0.25; 20 4.3,0.75; 21 4.3,1.25; 22 4.3,1.75; 23 4.3,2.25; 24 4.3,2.75; 37 -4.3,2.75; 38 -4.3,2.25; 39 -4.3,1.75; 40 -4.3,1.25; 41 -4.3,0.75; 42 -4.3,0.25; 43 -4.3,-0.25; 44 -4.3,-0.75; 45 -4.3,-1.25; 46 -4.3,-1.75; 47 -4.3,-2.25; 48 -4.3,-2.75
SO-08MN = smd 0.61 x 2.921: 1 -1.905,-2.981; 2 -0.635,-2.981; 3 0.635,-2.981; 4 1.905,-2.981; 5 1.905,2.981; 6 0.635,2.981; 7 -0.635,2.981; 8 -1.905,2.981
SLP2510P8 = smd 0.2 x 0.675: 1 -1,-0.438; 2 -0.5,-0.438; 4 0.5,-0.438; 5 1,-0.438; 6 1,0.438; 7 0.5,0.438; 9 -0.5,0.438; 10 -1,0.438 | smd 0.4 x 0.775: 3 0,-0.388; 8 0,0.388
SOT23-5 = smd 1.2 x 0.55: 1 1.3,-0.95; 2 1.3,0; 3 1.3,0.95; 4 -1.3,0.95; 5 -1.3,-0.95
QFN48 = smd 0.2 x 0.9: 1 -2.2,-3; 2 -1.8,-3; 3 -1.4,-3; 4 -1,-3; 5 -0.6,-3; 6 -0.2,-3; 7 0.2,-3; 8 0.6,-3; 9 1,-3; 10 1.4,-3; 11 1.8,-3; 12 2.2,-3; 25 2.2,3; 26 1.8,3; 27 1.4,3; 28 1,3; 29 0.6,3; 30 0.2,3; 31 -0.2,3; 32 -0.6,3; 33 -1,3; 34 -1.4,3; 35 -1.8,3; 36 -2.2,3 | smd 0.9 x 0.2: 13 3,-2.2; 14 3,-1.8; 15 3,-1.4; 16 3,-1; 17 3,-0.6; 18 3,-0.2; 19 3,0.2; 20 3,0.6; 21 3,1; 22 3,1.4; 23 3,1.8; 24 3,2.2; 37 -3,2.2; 38 -3,1.8; 39 -3,1.4; 40 -3,1; 41 -3,0.6; 42 -3,0.2; 43 -3,-0.2; 44 -3,-0.6; 45 -3,-1; 46 -3,-1.4; 47 -3,-1.8; 48 -3,-2.2 | drill 1.2 pad 1.422 square: N1 0,0 | drill 0.3 pad 0.4 square: N2 -1.6,0.65; N3 -1,0.65; N4 -1.6,-0.65; N5 -1,-0.65; N6 -0.65,-1.6; N7 -0.65,-1; N8 0.65,-1.6; N9 0.65,-1; N10 1.6,-0.65; N11 1,-0.65; N12 1.6,0.65; N13 1,0.65; N14 0.65,1.6; N15 0.65,1; N16 -0.65,1.6; N17 -0.65,1 | smd 4 x 4: VSS 0,0
SOT23' = smd 1 x 1.4: 1 -0.95,-1.1; 2 0.95,-1.1; 3 0,1.1
SOT23-6 = smd 1.2 x 0.55: 1 1.3,-0.95; 2 1.3,0; 3 1.3,0.95; 4 -1.3,0.95; 5 -1.3,0; 6 -1.3,-0.95
FIDUCIAL-1X3 = smd 1 x 1: 1 0,0
HAMMOND_1593LBK_A10_LIME = hole 3.3: 14.98,15.81; 14.98,43.81 | hole 0.6: 21.55,4.81; 21.55,54.81; 62.41,4.81; 62.41,54.81 | hole 0.5: 0.95,58.66; 83.01,58.66; 83.01,0.95; 0.95,0.95
HN1X3 = drill 1 pad 1.778 square: 1 -2.54,0 | drill 1 pad 1.778: 2 0,0; 3 2.54,0
USB_A_VERTICAL_PTH = drill 1: 1 3.45,12.75; 2 3.45,14.75; 3 3.45,16.75; 4 3.45,18.75 | drill 1.5: P$1 0.6,12.25; P$2 6.3,12.25; P$3 6.3,19.25; P$4 0.6,19.25
USB_MINI_9PIN = smd 2.25 x 0.5: D+ 2.706,0; D- 2.706,0.8; GND 2.706,-1.6; ID 2.706,-0.8; VBUS 2.706,1.6 | smd 4 x 2.1: GND1 -1.9,4.95; GND3 -1.9,-4.95 | smd 3.5 x 2.1: GND2 2.35,4.95; GND4 2.35,-4.95 | hole 1: 0,2.2; 0,-2.2
SOT-23-5 = smd 1.2 x 0.55: 1 1.3,-0.95; 2 1.3,0; 3 1.3,0.95; 4 -1.3,0.95; 5 -1.3,-0.95

## Placement (x,y rotation side)
1.2V_CPU224  TESTPADTESTPAD_40-ROUND  [TESTPAD_40-ROUND]  54.23,50.8 0 bottom
1.2V_INT224  TESTPADTESTPAD_40-ROUND  [TESTPAD_40-ROUND]  49.28,41.02 0 bottom
1.5V224  TESTPADTESTPAD_40-ROUND  [TESTPAD_40-ROUND]  46.74,47.88 0 bottom
2.5V224  TESTPADTESTPAD_40-ROUND  [TESTPAD_40-ROUND]  22.73,36.32 0 bottom
3.0VA224  TESTPADTESTPAD_40-ROUND  [TESTPAD_40-ROUND]  20.07,49.78 0 bottom
3.3V224  TESTPADTESTPAD_40-ROUND  [TESTPAD_40-ROUND]  50.04,47.88 0 bottom
5V_E224  Open  [SJ_1_SMALLER]  69.34,52.83 270 bottom
5V_E_SATA224  [SJ_1_SMALLER]  7.49,57.53 0 bottom
5V_SATA_PWR224  CON2DW02R  [DW02R]  4.45,54.99 270 top
5VEXT224  TESTPADTESTPAD_40-ROUND  [TESTPAD_40-ROUND]  65.79,51.44 0 bottom
+5V224  TESTPADTESTPAD_40-ROUND  [TESTPAD_40-ROUND]  11.56,37.47 0 bottom
BAT224  TESTPADTESTPAD_40-ROUND  [TESTPAD_40-ROUND]  70.61,42.16 0 bottom
C1  220nF  [C0402_TI]  64.64,17.78 180 top
C2  220nF  [C0402_TI]  56.32,18.29 270 top
C3  220nF  [C0402_TI]  43.46,24.05 180 bottom
C4  220nF  [C0402_TI]  43.36,25.04 180 bottom
C5  220nF  [C0402_TI]  43.46,27.79 180 bottom
C6  220nF  [C0402_TI]  43.46,28.68 180 bottom
C7  220nF  [C0402_TI]  44.77,25.91 270 bottom
C8  220nF  [C0402_TI]  43.46,31.57 180 bottom
C9  220nF  [C0402_TI]  63.25,21.59 0 bottom
C10  220nF  [C0402_TI]  57.85,22.22 180 bottom
C11  220nF  [C0402_TI]  43.05,33.1 90 bottom
C12  220nF  [C0402_TI]  43.99,33.1 90 bottom
C13  220nF  [C0402_TI]  55.44,18.29 270 top
C14  220nF  [C0402_TI]  62.29,18.29 90 top
C15  22uF/6.3V  [C0603_DWS]  47.12,41.02 180 bottom
C16  220nF  [C0402_TI]  43.46,29.57 0 bottom
C17  220nF  [C0402_TI]  43.46,30.56 0 bottom
C18  220nF  [C0402_TI]  38.28,29.29 270 bottom
C19  220nF  [C0402_TI]  61.21,21.59 0 bottom
C20  220nF  [C0402_TI]  51.05,21.84 0 top
C21  220nF  [C0402_TI]  56.77,25.65 270 bottom
C22  220nF  [C0402_TI]  60.71,39.37 0 bottom
C23  220nF  [C0402_TI]  61.09,32.51 0 bottom
C24  220nF  [C0402_TI]  56.64,39.37 0 bottom
C25  220nF  [C0402_TI]  60.25,22.97 180 bottom
C26  220nF  [C0402_TI]  57.66,36.07 180 bottom
C27  220nF  [C0402_TI]  61.55,25.92 270 bottom
C28  220nF  [C0402_TI]  66.8,28.58 90 bottom
C29  220nF  [C0402_TI]  66.8,37.21 90 top
C30  220nF  [C0402_TI]  66.8,28.58 90 top
C31  220nF  [C0402_TI]  66.8,24.26 90 top
C32  220nF  [C0402_TI]  66.8,30.73 270 top
C33  220nF  [C0402_TI]  66.8,24.26 90 bottom
C34  220nF  [C0402_TI]  66.8,30.73 270 bottom
C35  220nF  [C0402_TI]  64.64,37.97 0 bottom
C36  220nF  [C0402_TI]  66.8,22.1 270 top
C37  220nF  [C0402_TI]  37.21,23.5 90 bottom
C38  220nF  [C0402_TI]  36.53,27.94 0 bottom
C39  220nF  [C0402_TI]  36.19,31.5 180 bottom
C40  220nF  [C0402_TI]  38.28,27.36 270 bottom
C41  220nF  [C0402_TI]  33.86,24.87 180 bottom
C42  220nF  [C0402_TI]  43.36,26.9 0 bottom
C43  220nF  [C0402_TI]  40.79,27.94 180 bottom
C44  220nF  [C0402_TI]  41.17,33.1 270 bottom
C45  220nF  [C0402_TI]  40.23,33.1 270 bottom
C46  220nF  [C0402_TI]  42.11,33.1 270 bottom
C47  220nF  [C0402_TI]  58.67,39.37 180 bottom
C48  220nF  [C0402_TI]  56.9,40.64 180 top
C49  220nF  [C0402_TI]  54.23,39.37 180 bottom
C50  220nF  [C0402_TI]  53.85,40.64 0 top
C51  220nF  [C0402_TI]  58.17,37.59 270 bottom
C52  220nF  [C0402_TI]  51.05,22.86 0 top
C53  220nF  [C0402_TI]  62.74,39.37 0 bottom
C54  220nF  [C0402_TI]  51.18,39.75 90 top
C55  220nF  [C0402_TI]  55.37,31.11 0 bottom
C56  220nF  [C0402_TI]  66.8,32.89 90 top
C57  220nF  [C0402_TI]  66.8,22.1 270 bottom
C58  220nF  [C0402_TI]  66.8,32.89 90 bottom
C59  220nF  [C0402_TI]  66.8,37.21 90 bottom
C60  220nF  [C0402_TI]  66.8,26.42 270 top
C61  220nF  [C0402_TI]  66.8,35.05 270 top
C62  220nF  [C0402_TI]  66.8,26.42 270 bottom
C63  220nF  [C0402_TI]  62.67,37.97 0 bottom
C64  220nF  [C0402_TI]  66.8,35.05 270 bottom
C65  220nF  [C0402_TI]  39.98,23.5 90 bottom
C66  220nF  [C0402_TI]  54.74,49.78 0 bottom
C67  220nF  [C0402_TI]  39.01,23.5 90 bottom
C68  220nF  [C0402_TI]  36.25,23.5 90 bottom
C69  220nF  [C0402_TI]  38.11,23.5 90 bottom
C70  220nF  [C0402_TI]  38.28,25.43 270 bottom
C71  22uF/6.3V  [C0603_DWS]  64.26,11.05 180 top
C72  100nF  [C0402_TI]  56.32,16.32 270 top
C73  100nF  [C0402_TI]  63.63,12.19 0 bottom
C74  220nF  [C0402_TI]  39.29,33.1 90 bottom
C75  220nF  [C0402_TI]  36.45,33.1 90 bottom
C76  220nF  [C0402_TI]  38.35,33.15 90 bottom
C77  22uF/6.3V  [C0603_DWS]  52.58,13.59 0 top
C78  100nF  [C0402_TI]  59.69,9.21 180 top
C79  100nF  [C0402_TI]  52.2,14.86 0 top
C80  NA  [C0402_TI]  53.66,18.29 270 top
C81  NA  [C0402_TI]  55.5,5.21 270 bottom
C82  100nF  [C0402_TI]  59.69,8.32 180 top
C83  22uF/6.3V  [C0603_DWS]  60.2,17.91 180 top
C84  100nF  [C0402_TI]  58.1,16.32 270 top
C85  100nF  [C0402_TI]  57.21,16.32 270 top
C86  22uF/6.3V  [C0603_DWS]  68.07,18.8 0 bottom
C87  22uF/6.3V  [C0603_DWS]  68.07,20.32 0 bottom
C88  100nF  [C0402_TI]  63.63,10.41 0 bottom
C89  100nF  [C0402_TI]  55.44,16.32 270 top
C90  100nF  [C0402_TI]  53.09,9.78 180 top
C91  100nF  [C0402_TI]  51.18,18.03 270 bottom
C92  220nF  [C0402_TI]  33.86,31.32 0 bottom
C93  220nF  [C0402_TI]  38.66,35.08 0 bottom
C94  220nF  [C0402_TI]  33.86,27.69 180 bottom
C95  220nF  [C0402_TI]  37.59,16.89 90 top
C96  220nF  [C0402_TI]  38.28,31.22 90 bottom
C97  220nF  [C0402_TI]  43.46,22.99 0 bottom
C98  220nF  [C0402_TI]  41.91,23.5 90 bottom
C99  220nF  [C0402_TI]  40.94,23.5 90 bottom
C100  220nF  [C0402_TI]  35.28,23.5 90 bottom
C101  100nF  [C0402_TI]  63.63,13.97 0 bottom
C102  100nF  [C0402_TI]  73.03,9.78 0 bottom
C103  100nF  [C0402_TI]  73.03,8.89 0 bottom
C104  27pF  [C0603_DWS]  52.45,18.67 270 bottom
C105  27pF  [C0603_DWS]  60.07,18.67 270 bottom
C106  220nF  [C0402_TI]  33.86,23.95 0 bottom
C107  220nF  [C0402_TI]  33.86,22.99 0 bottom
C108  1uF  [C0603_DWS]  37.47,15.11 180 top
C109  100nF  [C0402_TI]  36.13,16.32 180 top
C110  10pF  [C0402_TI]  45.34,16 0 bottom
C111  100n  [C0402_TI]  56.64,11.56 180 top
C112  100nF  [C0402_TI]  18.41,41.27 180 top
C113  100nF  [C0402_TI]  20.7,41.27 0 top
C114  100nF  [C0402_TI]  20.19,18.41 0 top
C115  10pF  [C0402_TI]  43.31,16 180 bottom
C116  33pF  [C0603_DWS]  25.15,27.56 90 bottom
C117  33pF  [C0603_DWS]  25.15,30.86 270 bottom
C118  22uF/6.3V  [C0603_DWS]  51.31,18.67 90 top
C119  100nF  [C0402_TI]  43.36,25.93 0 bottom
C120  22uF/6.3V  [C0603_DWS]  31.62,41.02 180 top
C121  220nF  [C0402_TI]  34.01,30.43 180 bottom
C122  22uF/6.3V  [C0603_DWS]  16.38,7.75 0 bottom
C123  22uF/6.3V  [C0603_DWS]  25.78,34.16 90 bottom
C124  22uF/6.3V  [C0603_DWS]  16.38,9.27 0 bottom
C125  1uF  [C0603_DWS]  26.54,44.7 180 bottom
C126  220nF  [C0402_TI]  26.54,42.61 180 bottom
C127  10uF/6.3V  [C0603_DWS]  25.91,41.27 0 top
C128  10uF/6.3V  [C0603_DWS]  25.91,44.32 0 top
C129  220nF  [C0402_TI]  26.54,43.5 180 bottom
C130  220nF  [C0402_TI]  22.35,22.73 270 bottom
C131  220nF  [C0402_TI]  21.46,22.73 270 bottom
C132  220nF  [C0402_TI]  33.15,39.24 270 top
C133  220nF  [C0402_TI]  34.04,39.24 270 top
C134  10uF/6.3V  [C0603_DWS]  35.56,39.37 270 bottom
C135  100nF  [C0402_TI]  25.78,13.21 270 bottom
C136  100nF  [C0402_TI]  18.92,15.75 90 bottom
C137  100nF  [C0402_TI]  18.92,11.56 270 bottom
C138  22uF/6.3V  [C0603_DWS]  25.15,15.75 0 bottom
C139  1nF  [C0402_TI]  55.88,54.61 90 bottom
C140  1nF  [C0402_TI]  55.88,58.42 270 bottom
C141  1nF  [C0402_TI]  57.15,54.61 90 bottom
C142  1nF  [C0402_TI]  57.15,58.42 270 bottom
C143  22uF/6.3V  [C0603_DWS]  20.19,22.35 270 bottom
C144  220nF  [C0402_TI]  33.86,26.8 180 bottom
C145  22uF/6.3V  [C0603_DWS]  50.67,42.67 90 top
C146  10uF/6.3V  [C0603_DWS]  78.36,28.45 0 bottom
C147  22uF/6.3V  [C0603_DWS]  78.36,30.35 180 bottom
C148  220nF  [C0402_TI]  33.86,25.83 180 bottom
C149  100nF  [C0402_TI]  77.47,33.66 270 bottom
C150  10uF/6.3V  [C0603_DWS]  78.36,20.32 0 bottom
C151  22uF/6.3V  [C0603_DWS]  78.36,22.22 180 bottom
C152  100nF  [C0402_TI]  77.47,26.54 90 bottom
C153  10nF  [C0402_TI]  8.64,40.13 0 bottom
C154  10nF  [C0402_TI]  8.64,41.02 0 bottom
C155  10uF/6.3V  [C0603_DWS]  71.37,39.5 0 bottom
C156  10nF  [C0402_TI]  8.64,43.94 0 bottom
C157  10nF  [C0402_TI]  8.64,44.83 0 bottom
C158  10uF/6.3V  [C0603_DWS]  65.66,39.24 180 bottom
C159  1uF  [C0603_DWS]  72.9,46.23 0 bottom
C160  10uF/6.3V  [C0603_DWS]  75.31,41.66 270 top
C161  10uF/6.3V  [C0603_DWS]  72.9,47.75 180 bottom
C162  10uF/6.3V  [C0603_DWS]  69.98,48.13 90 bottom
C163  10uF/6.3V  [C0603_DWS]  65.15,42.93 270 bottom
C164  220nF  [C0402_TI]  37.39,33.1 90 bottom
C165  22uF/6.3V  [C0603_DWS]  43.81,41.02 0 bottom
C166  10uF/6.3V  [C0603_DWS]  53.09,50.04 90 top
C167  1nF  [C0402_TI]  54.36,50.42 90 top
C168  22uF/6.3V  [C0603_DWS]  7.49,54.99 90 bottom
C169  NA(22uF/6.3V)  [C0603_DWS]  5.97,54.99 90 bottom
C170  10uF/6.3V  [C0603_DWS]  66.93,51.18 0 top
C171  1uF  [C0603_DWS]  58.93,41.53 90 bottom
C172  10uF/6.3V  [C0603_DWS]  53.47,44.45 90 top
C173  1nF  [C0402_TI]  52.2,44.45 90 top
C174  10uF/6.3V  [C0603_DWS]  60.2,49.02 90 bottom
C175  22uF/6.3V/0603  [C0603_DWS]  7.49,51.69 90 bottom
C176  1uF  [C0603_DWS]  62.1,42.93 270 bottom
C177  22uF/6.3V  [C0603_DWS]  23.49,34.16 90 bottom
C178  220nF  [C0402_TI]  33.86,29.54 180 bottom
C179  10uF/6.3V  [C0603_DWS]  63.63,42.93 90 bottom
C180  1uF  [C0603_DWS]  59.56,40.83 0 top
C181  22uF/6.3V  [C0603_DWS]  49.15,42.67 90 top
C182  10uF/6.3V  [C0603_DWS]  60.45,41.53 90 bottom
C183  10uF/6.3V  [C0603_DWS]  58.67,49.02 90 bottom
C184  220nF  [C0402_TI]  33.86,28.58 180 bottom
C185  10uF/6.3V  [C0603_DWS]  71.88,42.55 0 top
C186  10uF/6.3V  [C0603_DWS]  71.88,41.02 0 top
C187  1nF  [C0402_TI]  69.98,48.64 270 top
C188  10uF/6.3V  [C0603_DWS]  56.52,49.02 90 bottom
C189  220nF  [C0402_TI]  33.63,33.1 270 bottom
C190  22uF/6.3V  [C0603_DWS]  21.97,34.16 90 bottom
C191  22uF/6.3V  [C0603_DWS]  19.43,50.55 0 top
C192  22uF/6.3V  [C0603_DWS]  19.69,43.69 180 top
C193  100nF  [C0402_TI]  20.07,44.96 180 top
C194  220nF  [C0402_TI]  35.51,33.1 270 bottom
C195  22uF/6.3V  [C0603_DWS]  35.18,44.07 0 top
C196  220nF  [C0402_TI]  34.57,33.1 270 bottom
C197  470nF  [C0603_DWS]  35.18,42.55 0 top
C198  22uF/6.3V  [C0603_DWS]  31.62,42.55 180 top
C199  470nF  [C0603_DWS]  35.18,41.02 0 top
C200  470uF/10V/105C  [E2,5-6,3]  69.09,56.13 90 top
C201  22pF  [C0603_DWS]  46.74,45.72 270 bottom
C202  22uF/6.3V  [C0603_DWS]  54.36,41.47 90 bottom
C203  22uF/6.3V  [C0603_DWS]  51.82,45.72 270 bottom
C204  22uF/6.3V  [C0603_DWS]  53.34,45.72 270 bottom
C205  22uF/6.3V  [C0603_DWS]  77.72,42.55 180 bottom
C206  22uF/6.3V  [C0603_DWS]  77.72,41.02 180 bottom
C207  22uF/6.3V  [C0603_DWS]  80.14,43.43 270 bottom
C208  22uF/6.3V  [C0603_DWS]  77.22,48.39 180 bottom
C209  1nF  [C0402_TI]  24.51,51.05 180 bottom
C210  22uF/6.3V  [C0603_DWS]  31.75,52.96 90 bottom
C211  22pF  [C0603_DWS]  25.78,57.78 270 top
C212  22uF/6.3V  [C0603_DWS]  27.3,57.78 270 bottom
C213  22uF/6.3V  [C0603_DWS]  25.78,57.78 270 bottom
C214  1nF/2kV/X7R/1206  [C1206_5MILS_WS_ISO]  77.47,3.3 0 bottom
C215  NA(47uF/6.3V/tant)  [CT3528_MIL]  72.14,30.86 0 top
C216  NA(47uF/6.3V/tant)  [CT3528_MIL]  72.14,30.86 180 bottom
C217  NA(47uF/6.3V/tant)  [CT3528_MIL]  80.39,21.59 180 top
C218  NA(47uF/6.3V/tant)  [CT3528_MIL]  80.39,30.86 180 top
C219  NA(47uF/6.3V/tant)  [CT3528_MIL]  22.86,13.97 180 top
C220  NA(22uF/6.3V)  [C0603_DWS]  72.14,33.66 180 bottom
C221  NA(22uF/6.3V)  [C0603_DWS]  73.66,23.24 90 bottom
C222  NA(22uF/6.3V)  [C0603_DWS]  72.14,23.24 90 bottom
C223  NA(22uF/6.3V)  [C0603_DWS]  70.61,23.24 90 bottom
CHGLED224  LED/YELLOW/0603  [LED-0603]  77.85,41.02 180 top
D1  1N5819(S4SOD-123)  [SOD-123]  52.45,52.96 0 bottom
D2  1N5819(S4SOD-123)  [SOD-123]  68.83,4.06 0 bottom
D3  SMBJ6.0A  [DO214AA]  77.6,52.32 90 bottom
D4  NA(1N5822/SS34/SMA)  [MLL-41]  77.6,58.29 0 bottom
D5  1N5822/SS34/SMA  [MELF-MLL41]  80.39,38.73 180 bottom
FET1  IRLML6402  [SOT23]  10.29,57.28 270 bottom
FET2  BSS138  [SOT23]  71.88,53.34 270 bottom
FET3  IRLML6402  [SOT23]  71.88,57.4 0 bottom
FET4  IRLML6402  [SOT23]  71.5,51.31 90 top
FUSE1  FSMD035  [1206]  11.56,31.75 270 bottom
GND224  TESTPADTESTPAD_40-ROUND  [TESTPAD_40-ROUND]  17.27,58.67 0 bottom
GND_PIN224  TESTPAD3  [TEST_PAD40/70/SQUARE]  26.16,1.27 0 top
GPIO-1  GPH127SMT-02X20(PA-V16X-2X20-LF)  [GPH127SMT-02X20(PA-V16X-2X20-LF)]  38.1,50.16 0 top
GPIO-2  GPH127SMT-02X20(PA-V16X-2X20-LF)  [GPH127SMT-02X20(PA-V16X-2X20-LF)]  38.1,9.52 0 top
GPIO-3  GPH127SMT-02X20(PA-V16X-2X20-LF)  [GPH127SMT-02X20(PA-V16X-2X20-LF)]  45.08,3.17 0 top
GPIO-4  GPH127SMT-02X10(PA-V16X-2X10-LF)  [GPH127SMT-02X10(PA-V16X-2X10-LF)]  14.86,53.09 90 top
HDMI224  HDMI-SWM-19  [HDMI-SWM-19]  4.19,25.27 90 top
IPSOUT224  TESTPADTESTPAD_40-ROUND  [TESTPAD_40-ROUND]  58.8,45.59 0 bottom
L1  0R/0805  [L0805_5MIL_DWS]  63.63,13.84 270 top
L2  0R/0805  [L0805_5MIL_DWS]  53.34,11.81 0 top
L3  0R/0805  [L0805_5MIL_DWS]  60.58,16.13 180 top
L4  4.7uH/1.15A/DCR<0.1R/CD43  [CD42(43)]  63.37,17.78 180 bottom
L5  CL470nH/0805/0.3R/250mA  [L0805_5MIL_DWS]  16.13,5.21 0 bottom
L6  FB0805/600R/2A  [L0805_5MIL_DWS]  21.46,15.75 180 bottom
L7  FB0805/600R/2A  [L0805_5MIL_DWS]  9.4,3.17 270 top
L8  FB0805/600R/2A  [L0805_5MIL_DWS]  78.99,33.15 90 bottom
L9  FB0805/600R/2A  [L0805_5MIL_DWS]  71.78,27.84 0 bottom
L10  FB0805/600R/2A  [L0805_5MIL_DWS]  78.99,25.02 90 bottom
L11  2.2uH/1.5A/DCR<0.1R/CD32  [CD32]  72.39,46.23 270 top
L12  2.2uH/1.5A/DCR<0.1R/CD32  [CD32]  56.77,50.93 270 top
L13  2.2uH/1.5A/DCR<0.1R/CD32  [CD32]  56.26,45.21 270 top
L14  2.2uH/1.5A/DCR<0.1R/CD32  [CD32]  56.13,45.21 90 bottom
L15  2.2uH/1.5A/DCR<0.1R/CD32  [CD32]  81.41,47.37 270 bottom
L16  2.2uH/1.5A/DCR<0.1R/CD32  [CD32]  30.35,57.4 0 bottom
LAN224  TM211Q01FM22_SH  [TM211Q01FM22_SH]  76.96,12.06 270 top
LCD_CON224  GPH127SMT-02X20(PA-V16X-2X20-LF)  [GPH127SMT-02X20(PA-V16X-2X20-LF)]  45.08,56.52 0 top
LED1  LED/GREEN/0603  [LED-0603]  28.7,2.16 90 top
LIPO_BAT224  CON2DW02R  [DW02R]  81.53,43.43 90 top
NAND_E224  Close  [SJ_1_SMALLER_CLOSE_10MILS]  19.81,36.19 270 bottom
PC3/PB8  [SJ_2_SMALL_23_TIED]  10.29,47.24 180 bottom
PWR224  SIDE_WTCM-TR(3X4)  [SW_TAKT3X4]  1.27,54.36 270 bottom
PWR_JACK224  YDJ-1136  [PWR_JACK_UNI_MILLING]  74.3,56.64 180 top
PWR_LED224  LED/RED/0603  [LED-0603]  78.61,58.55 180 top
Q1  E4SB25.000F20E15(25MHz/20pF/20ppm/5x3.2mm)  [HCX-4S]  56.26,18.86 0 bottom
Q3  4SB24.000F20E15/5x3.2mm/20ppm/20pF  [HCX-4S]  22.61,29.21 270 bottom
Q4  32768Hz/6pF  [MC-306]  43.43,10.29 270 bottom
R1  2k/1%  [R0402_TI]  64.64,18.67 0 top
R2  2k/1%  [R0402_TI]  57.21,18.29 90 top
R3  NA  [R0402_TI]  58.1,18.29 270 top
R4  2k/1%  [R0402_TI]  63.18,18.29 90 top
R5  2k/1%  [R0402_TI]  54.55,18.29 270 top
R6  2k/1%  [R0402_TI]  46.36,37.85 0 bottom
R7  330R/1%  [R0603_5MIL_DWS]  63.65,35.49 0 bottom
R8  330R/1%  [R0603_5MIL_DWS]  62.25,24.19 0 bottom
R9  22R  [R0402_TI]  50.29,32.89 180 top
R10  22R  [R0402_TI]  50.29,33.78 180 top
R11  0R_board_mounted  [R0402_TI_0R]  46.36,36.96 0 bottom
R12  NA(4.7k)  [R0402_TI]  58.17,2.41 270 bottom
R13  0R_board_mounted  [R0402_TI_0R]  46.36,36.07 0 bottom
R14  330R/1%  [R0603_5MIL_DWS]  43.81,39.5 0 bottom
R15  10k  [R0402_TI]  60.71,10.67 90 top
R16  22R  [R0402_TI]  61.59,10.67 90 top
R17  22R  [R0402_TI]  56.52,9.72 0 top
R18  10k  [R0402_TI]  54.67,13.84 90 top
R19  NA  [R0402_TI]  54.55,16.32 270 top
R20  1k  [R0402_TI]  79.5,7.87 270 bottom
R21  4.7k  [R0402_TI]  81.53,7.87 90 bottom
R22  10k  [R0402_TI]  22.73,41.27 0 top
R23  10k  [R0402_TI]  21.72,42.16 0 top
R24  1k  [R0402_TI]  56.64,13.34 0 top
R25  NA(22R)  [R0402_TI]  56.64,14.22 180 top
R26  2.49k/1%  [R0603_5MIL_DWS]  59.69,13.84 180 top
R27  47k  [R0402_TI]  54.61,55.12 270 bottom
R28  NA  [R0402_TI]  18.22,36.19 90 bottom
R29  10k  [R0402_TI]  18.41,42.16 180 top
R30  47k  [R0402_TI]  36.13,17.21 0 top
R31  470k  [R0402_TI]  54.93,9.78 270 top
R32  4.7k  [R0402_TI]  79.5,16.38 90 bottom
R33  NA  [R0402_TI]  53.66,16.32 90 top
R34  NA  [R0402_TI]  56.64,10.67 180 top
R35  10M  [R0402_TI]  44.32,16.89 0 bottom
R36  1k  [R0402_TI]  81.53,16.38 90 bottom
R37  4.7k  [R0402_TI]  52.2,15.75 180 top
R38  NA  [R0402_TI]  56.64,12.45 180 top
R39  NA(2.2k)  [R0402_TI]  73.66,13.46 270 bottom
R40  NA(2.2k)  [R0402_TI]  72.64,13.46 90 bottom
R41  100k/1%  [R0603_5MIL_DWS]  16.38,12.32 180 bottom
R42  10k  [R0402_TI]  16.38,10.54 180 bottom
R43  200k/1%  [R0603_5MIL_DWS]  25.91,42.8 180 top
R44  10k  [R0402_TI]  8.89,15.75 90 top
R45  2k/1%  [R0402_TI]  13.34,32.13 90 top
R46  2k/1%  [R0402_TI]  12.45,32.13 90 top
R47  47k  [R0402_TI]  13.46,33.02 90 bottom
R48  NA(0R)  [R0603_5MIL_DWS]  42.61,40.39 90 top
R49  NA  [R0603_5MIL_DWS]  51.82,56.39 0 bottom
R50  NA  [R0603_5MIL_DWS]  52.45,54.86 0 bottom
R51  4.99k/1%  [R0603_5MIL_DWS]  21.46,13.97 180 bottom
R52  10k  [R0402_TI]  21.08,9.14 0 bottom
R53  13k/1%  [R0603_5MIL_DWS]  24.51,9.91 270 bottom
R54  10k  [R0402_TI]  24.51,13.21 90 bottom
R55  47k  [R0402_TI]  10.92,3.17 90 top
R56  2.2k  [R0402_TI]  44.58,45.72 270 bottom
R57  2.2k  [R0402_TI]  45.47,45.72 270 bottom
R58  10k  [R0402_TI]  82.04,28.45 180 bottom
R59  6.8k/1%  [R0603_5MIL_DWS]  81.79,34.29 180 bottom
R60  2.2k  [R0402_TI]  52.07,48.51 270 bottom
R61  2.2k  [R0402_TI]  51.18,48.51 270 bottom
R62  10k  [R0402_TI]  82.04,20.32 180 bottom
R63  13k/1%  [R0603_5MIL_DWS]  81.79,26.16 180 bottom
R64  10k  [R0402_TI]  70.1,5.71 180 bottom
R65  100R  [R0603_5MIL_DWS]  71.88,39.5 180 top
R66  0.03R/1%  [R1206_5MIL_WS]  72.64,42.93 90 bottom
R67  100k/1%  [R0603_5MIL_DWS]  82.68,54.99 270 bottom
R68  10k  [R0402_TI]  10.29,54.48 180 bottom
R69  200k/1%  [R0603_5MIL_DWS]  82.68,51.18 270 bottom
R70  2.2k  [R0402_TI]  77.47,42.29 180 top
R71  10k  [R0402_TI]  9.78,48.89 180 bottom
R72  191R/1%  [R0603_5MIL_DWS]  26.54,40.89 180 bottom
R73  6.8k/1%  [R0603_5MIL_DWS]  5.97,51.69 270 bottom
R74  200k/1%  [R0603_5MIL_DWS]  59.56,42.35 0 top
R75  2.2k  [R0402_TI]  69.09,48.64 270 top
R76  47k  [R0402_TI]  68.07,58.93 180 bottom
R77  2.2k  [R0402_TI]  66.93,49.91 180 top
R78  10k  [R0402_TI]  72.52,50.16 0 bottom
R79  2.2k  [R0402_TI]  67.18,51.18 90 bottom
R80  2.2k  [R0402_TI]  62.74,40.32 0 bottom
R81  2.2k  [R0402_TI]  68.07,51.18 90 bottom
R82  2.2k  [R0402_TI]  75.82,58.55 0 top
R83  0R(Board_Mounted)  [0603_0R]  66.8,56.77 270 bottom
R84  1M  [R0402_TI]  74.17,49.02 0 bottom
R85  8.25k/1%  [R0603_5MIL_DWS]  75.31,41.66 270 bottom
R86  4.99k/1%  [R0603_5MIL_DWS]  48.77,45.72 270 bottom
R87  100k/1%  [R0603_5MIL_DWS]  23.88,49.78 180 bottom
R88  2.2k  [R0402_TI]  29.97,2.54 90 top
R89  1.1k/1%  [R0603_5MIL_DWS]  75.31,45.97 90 bottom
R90  3.32k/1%  [R0603_5MIL_DWS]  47.88,43.31 0 bottom
R91  4.99k/1%  [R0603_5MIL_DWS]  27.3,57.78 270 top
R92  1.1k/1%  [R0603_5MIL_DWS]  26.92,53.72 90 bottom
R93  NA(2.2k)  [R0402_TI]  30.61,12.32 270 bottom
R94  NA(2.2k)  [R0402_TI]  31.88,12.32 270 bottom
R95  NA(2.2k)  [R0402_TI]  32.77,12.32 270 bottom
R96  NA(2.2k)  [R0402_TI]  29.72,12.32 270 bottom
RECOVERY224  SIDE_WTCM-TR(3X4)  [SW_TAKT3X4]  1.27,37.85 270 bottom
RESET224  SIDE_WTCM-TR(3X4)  [SW_TAKT3X4]  1.27,46.1 270 bottom
RM1  RA0805_(4X0402)_4B8_4.7k  [R_MATRIX_4_0402_25X625]  57.28,5.21 180 bottom
RM2  RA0805_(4X0402)_4B8_22R  [R_MATRIX_4_0402_25X625]  57.28,7.75 0 top
RM3  RA1206_(4X0603)_4B8_100K  [R_MATRIX_4]  16.38,2.16 270 bottom
RM4  RA0805_(4X0402)_4B8_4.7k  [R_MATRIX_4_0402_25X625]  49.78,2.67 180 bottom
SATA224  SATA-PWA-07  [SATA-PWA-07]  3.98,42.91 90 top
SD/MMC224  MICRO_SD/MMC_CP_NEWTFC-WPAPR-08  [TFC-WPAPR-08]  5.45,8.63 0 bottom
T1  BC846B  [SOT23]  10.29,51.69 0 bottom
U1  A20  [TFBGA441]  38.65,28.29 90 top
U2  K4B4G1646D-BCK0  [FBGA96_SK]  59.05,35.19 0 top
U3  K4B4G1646D-BCK0  [FBGA96_SK]  59.05,24.29 0 top
U4  H27UBG8T2BTR  [TSOP48]  20.19,29.84 270 top
U5  RTL8211CL-GR  [LQFP48]  56.26,12.06 270 bottom
U6  AT24C16BN-SH  [SO-08MN]  79.12,12.06 270 bottom
U7  NA(RCLAMP0524P)  [SLP2510P8]  12.06,22.35 90 top
U8  NA(RCLAMP0524P)  [SLP2510P8]  12.06,25.4 90 top
U9  NA(RCLAMP0524P)  [SLP2510P8]  12.06,28.32 90 top
U10  SY6280  [SOT23-5]  21.46,11.56 180 bottom
U11  SY6280  [SOT23-5]  81.53,31.37 90 bottom
U12  SY6280  [SOT23-5]  81.53,23.24 90 bottom
U13  AXP209(QFN48)  [QFN48]  65.15,44.96 180 top
U14  MCP120T475I-TT  [SOT23']  76.71,45.28 270 top
U15  SY8008C(AA)C  [SOT23-5]  51.82,41.91 90 bottom
U16  SY7208(SOT23-6)  [SOT23-6]  77.72,45.47 270 bottom
U17  SY8008C(AA)C  [SOT23-5]  29.34,52.32 90 bottom
U18  FIDUCIAL  [FIDUCIAL-1X3]  10.16,54.99 180 top
U19  FIDUCIAL  [FIDUCIAL-1X3]  81.79,12.06 180 top
U20  FIDUCIAL  [FIDUCIAL-1X3]  8.89,37.59 0 bottom
U21  FIDUCIAL  [FIDUCIAL-1X3]  81.53,2.67 0 bottom
U$2  [HAMMOND_1593LBK_A10_LIME]  0,0 0 top
U$5  [LOGO-OPENHARDWARE_8X8]  21.08,44.2 0 bottom
U$6  [OLIMEX1_V]  24,2.54 0 bottom
U$9  [PB]  39.24,51.82 0 bottom
U$10  [ESD_SYMBOL]  34.8,14.6 0 bottom
U$11  [RECYCLE_BIN1/8]  41.53,42.42 0 bottom
U$12  [ROHS]  17.53,22.86 0 bottom
UART0  HN1X3  [HN1X3]  69.85,1.52 0 top
USB_HOST1  USB_A_VERTICAL  [USB_A_VERTICAL_PTH]  87.88,32.26 90 top
USB_HOST2  USB_A_VERTICAL  [USB_A_VERTICAL_PTH]  87.88,22.61 90 top
USB_OTG224  USB-OTG  [USB_MINI_9PIN]  4.06,7.63 0 top
VR1  AP1231-2.5V(SOT23-5)  [SOT-23-5]  19.94,47.62 90 top

## Tracks (layer width: path | path; a pad name or v marks a point on that pad's centre or on a via)
5VEXT  (via drill 0.6)
  Top 0.203: U13.32 65.75,41 65.96,41 66.15,41 U13.33
  Top 0.508: 74.3,54.86 74.55,55.12 74.55,57.78 R82.1 | U14.2 75.86,44.07 78.61,44.07 78.99,44.45 78.99,46.99 75.95,50.04 74.3,50.04 PWR_JACK224.+
  Top 0.61: v66.22,40.26 65.96,40.51 65.96,41
  Top 1.016: PWR_JACK224.+ 74.3,54.86
  Route3 1.016: PWR_JACK224.+ 74.3,53.47 73.41,54.36 69.6,54.36 C200.+
  Route14 0.813: v66.22,40.26 66.22,41.2
  Route14 1.016: 66.22,41.2 66.22,41.71 68.58,44.07 68.58,46.23 69.85,47.5 72.77,47.5 74.3,49.02 PWR_JACK224.+
  Bottom 0.254: C200.+ 68.2,54.86 65.79,52.45 5VEXT224.1
  Bottom 0.508: 69.34,53.34 5V_E224.1
  Bottom 0.61: 74.3,50.42 74.04,50.16 R78.1
  Bottom 0.762: C200.+ 69.34,54.61 69.34,53.34 | C158.2 66.22,39.57 v66.22,40.26
  Bottom 1.016: D3.C 77.6,50.42 74.3,50.42 PWR_JACK224.+ 74.3,57.4 | D4.A 75.06,58.29 74.3,57.53 74.3,57.4 | 74.3,57.4 FET3.3
+5V  (via drill 0.4, 0.6)
  Top 0.508: v26.03,49.4 GPIO-1.1
  Top 0.61: 12.45,32.89 R46.2 R45.2 | v33.02,55.75 LCD_CON224.1
  Top 0.762: v26.03,8.76 GPIO-2.1 | v33.02,2.41 GPIO-3.1
  Top 0.889: v69.47,51.44 70.44,52.41 FET4.2
  Top 1.016: 12.45,32.89 11.56,33.78 v11.56,34.67 v11.56,35.69
  Route3 1.016: v81.41,58.29 70.87,58.29 70.23,58.93 v69.6,58.93
  Route4 1.016: v69.6,58.93 70.23,58.93 70.61,58.55 70.61,52.58 v69.47,51.44
  Route13 1.016: v11.56,34.67 v11.56,35.69 8.64,38.61 8.64,46.86 | v80.52,20.07 78.61,21.97 78.61,25.15 80.26,26.8 v80.26,28.45 80.26,29.72 81.53,30.99 81.53,33.27 80.26,34.54 80.26,38.23 68.71,49.78 68.71,51.44 | 33.02,52.7 v33.02,55.75 | 33.02,52.7 25.53,52.7 24,51.18 | 24,51.18 22.35,49.53 19.94,49.53 16.64,46.23 13.34,46.23 12.7,46.86 8.64,46.86 | 8.64,46.86 v8.64,57.53 | 33.02,52.7 57.4,52.7 59.56,50.55 63.75,50.55 64.14,50.93 64.64,50.93 65.15,51.44 68.71,51.44 | 68.71,51.44 v69.47,51.44 | v26.03,49.4 25.78,49.4 24,51.18
  Route14 0.508: 19.18,12.06 v18.29,12.06 | 19.18,12.19 v19.18,12.7
  Route14 1.016: v33.02,2.41 32.77,2.41 32.13,3.05 31.24,3.05 26.03,8.25 v26.03,8.76 25.53,8.76 23.24,11.05 19.94,11.05 19.18,11.81 | 19.18,11.81 19.18,12.06 19.18,12.19 | 19.18,11.81 15.52,11.81 12.19,15.14 12.19,34.04 v11.56,34.67 v11.56,35.69
  Bottom 0.254: v11.56,35.69 +5V224.1
  Bottom 0.508: 80.01,28.45 80.01,29.34 80.39,29.72 80.58,29.72 U11.5 | v80.52,20.07 80.58,20.13 U12.5 | 8,57.53 5V_E_SATA224.1 | U10.5 20,12.51 19.56,12.06 C137.1 | v18.29,12.06 C137.1 | C137.1 19.18,12.06 v19.18,12.7 | 69.34,52.32 5V_E224.2 | v69.6,58.93 R76.2
  Bottom 0.61: FET1.2 9.78,55.73 R68.1
  Bottom 0.762: 8,57.53 v8.64,57.53 9.34,56.83 FET1.2 | v69.47,51.44 69.34,51.56 69.34,52.32
  Bottom 1.016: v80.52,20.07 80.52,20.32 C150.1 | v80.26,28.45 80.01,28.45 C146.1 | FET3.2 70.21,58.93 v69.6,58.93 | v81.41,58.29 D4.K
  Bottom 1.524: FUSE1.1 v11.56,34.67 v11.56,35.69
+5V_OTG_PWR  (via drill 0.4, 0.6)
  Top 0.203: U13.31 65.35,41.3 65.1,41.05
  Top 0.508: v65.1,40.41 v65.1,41.02 65.1,41.05 | USB_OTG224.VBUS 9.14,9.23 9.7,9.23 v10.03,8.89
  Route4 0.635: v65.1,40.41 65.1,40.91 65.28,41.08
  Route4 1.016: v82.68,56.9 82.04,56.9 79.12,53.97 79.12,50.8 75.95,47.62 69.98,47.62 68.58,46.23 68.58,44.39 65.28,41.08
  Route13 0.61: v65.1,40.41 v65.1,41.02 65.1,41.45 65.02,41.53 65.02,41.66 64.9,41.78
  Route13 1.016: 64.9,41.78 64.64,42.04 59.44,42.04 58.42,43.05 51.05,43.05 48.13,40.13 42.55,40.13 40.89,41.78 37.08,41.78 35.81,40.51 34.29,40.51 33.66,39.88 21.34,39.88 12.19,30.73 12.19,11.05 v10.03,8.89
  Bottom 0.508: C136.1 19.94,15.24 L6.1
  Bottom 0.61: v65.1,40.41 v65.1,41.02 65.15,41.02 | C136.1 17.15,13.46 13.34,13.46 10.03,10.16 v10.03,8.89
  Bottom 0.813: 65.15,41.02 C163.2
  Bottom 1.016: v82.68,56.9 R67.1
+24V  (via drill 0.4, 0.6)
  Top 0.203: U13.38 68.91,43.16 68.91,43.36 68.91,43.56 U13.39 | v70.1,44.45 69.85,44.45 69.54,44.76 U13.42
  Top 0.61: 68.91,43.36 v69.16,43.1 v69.16,42.56
  Route3 1.016: v72.52,48.89 72.52,48.01 78.11,42.42 81.55,42.42 LIPO_BAT224.1
  PWR 0.508: v69.16,42.56 69.16,43.13
  Bottom 0.254: v69.16,42.56 70.22,42.56 BAT224.1
  Bottom 0.61: v69.16,42.56 69.16,42.67 | v72.52,48.89 72.52,49.02
  Bottom 0.813: 69.16,42.67 v69.16,43.1 69.16,43.51 v70.1,44.45 70.48,44.83 72.01,44.83
  Bottom 1.016: R66.2 72.2,44.83 72.01,44.83 C159.2 C161.1 72.01,48.01 72.52,48.51 v72.52,48.89 | LIPO_BAT224.1 80.25,42.43 C207.2
AVDD1  (via drill 0.3, 0.4)
  Top 0.381: v55.88,14.92 55.88,15.11 56.33,15.56 C72.2
  Top 0.762: v62.23,12.19 63.37,12.19 | L1.2 63.37,12.57 63.37,12.19 | 63.37,12.19 C71.2
  Route14 0.508: v55.88,14.92 56.71,15.75 59.56,15.75 62.23,13.08 v62.23,12.19
  Bottom 0.254: U5.6 62.11,12.31 v62.23,12.19 C73.2 | U5.41 55.51,15.48 55.88,15.11 v55.88,14.92
AVDD/DVDD(1.05V)  (via drill 0.3, 0.4, 0.6)
  Top 0.381: C89.2 55.44,15.56 55.25,15.37 v55.25,14.92
  Top 0.508: C90.2 52.58,10.03 v53.15,10.6
  Route13 0.508: 55.25,15.49 v55.25,14.92 | 50.8,15.37 v50.61,15.18
  Route13 0.762: 62.36,14.99 v62.36,13.97 63.12,13.21 v63.12,9.78 | 62.36,14.99 63.88,14.99 66.42,17.53 v66.42,17.91 | 55.25,16.13 55.25,15.49 | 55.25,16.13 59.69,16.13 60.83,14.99 62.36,14.99 | 52.32,15.37 50.8,15.37 | 52.32,15.37 52.96,15.37 53.72,16.13 55.25,16.13 | v53.15,10.6 52.32,11.43 52.32,15.37
  Bottom 0.127: v53.15,10.6 52.94,10.81 U5.28 | U5.36 51.18,14.81 51.18,15.3
  Bottom 0.254: U5.3 62.2,13.81 v62.36,13.97 C101.2 | v55.25,14.92 55.25,15.11 55.01,15.35 U5.40 | U5.10 63.12,10.31 v63.12,9.78 C88.2
  Bottom 0.406: v50.61,15.18 51.05,15.18 51.18,15.3 C91.2
  Bottom 1.016: 64.97,17.91 64.97,18.8 66.42,18.8 | 66.42,18.8 C86.2 C87.2 | 66.42,18.8 v66.42,17.91 64.97,17.91 | 64.97,17.91 L4.2
BA0  (via drill 0.25)
  Top 0.127: v62.25,33.19 U2.M2 | U1.K3 v46.25,26.29 | v62.25,22.29 U3.M2
  Route3 0.127: v62.25,33.19 61.82,32.77 61.4,32.77 61.28,32.64 61.28,32.38 61.4,32.26 61.72,32.26 61.85,32.13 61.85,31.88 61.72,31.75 61.4,31.75 61.28,31.62 61.28,31.37 61.4,31.24 62.23,31.24 62.36,31.11 62.36,29.46 62.23,29.34 61.91,29.34 61.78,29.21 61.78,28.36 v62.25,27.89 61.85,27.49 61.85,24.89 61.98,24.77 62.55,24.77 62.67,24.64 62.67,24.51 62.55,24.38 61.98,24.38 61.85,24.26 61.85,24.13 61.98,24 62.55,24 62.67,23.88 62.67,23.75 62.55,23.62 61.98,23.62 61.85,23.5 61.85,22.69 v62.25,22.29
  Bottom 0.127: v46.25,26.29 46.44,26.29 46.94,26.8 48.26,26.8 48.51,27.05 48.51,27.69 48.64,27.81 49.28,27.81 49.4,27.94 49.4,28.45 49.53,28.58 49.66,28.58 49.78,28.45 49.78,27.81 49.91,27.69 50.04,27.69 50.17,27.81 50.17,28.45 50.29,28.58 58.29,28.58 59.38,27.49 61.08,27.49 61.21,27.62 61.21,27.94 61.34,28.07 61.47,28.07 61.59,27.94 61.59,27.62 61.72,27.5 62.04,27.5 62.25,27.71 v62.25,27.89
BA1  (via drill 0.25)
  Top 0.127: v63.05,37.19 U2.N8 | U1.L4 v45.45,27.09 | v63.05,26.29 U3.N8
  Route3 0.127: v63.05,37.19 62.65,36.79 62.65,28.89 v63.05,28.49 62.65,28.09 62.65,25.23 63.37,24.51 63.37,23.75 63.5,23.62 64.26,23.62 64.39,23.75 64.39,24.26 63.45,25.2 63.45,25.89 v63.05,26.29
  Bottom 0.127: v45.45,27.09 45.85,27.49 47.31,27.49 47.5,27.69 47.5,28.58 47.62,28.7 47.75,28.7 47.88,28.58 47.88,28.19 48.01,28.07 48.13,28.07 49.15,29.08 58.55,29.08 59.06,28.58 62.97,28.58 v63.05,28.49
BA2  (via drill 0.25)
  Top 0.127: v62.25,33.99 U2.M3 | U1.K4 v45.45,26.29 | v62.25,23.09 U3.M3
  Route13 0.127: v62.25,23.09 62.25,23.35 62.1,23.5 61.72,23.5 61.59,23.62 61.59,23.75 61.72,23.88 63.06,23.88 63.18,24 63.18,24.13 63.06,24.26 61.72,24.26 61.59,24.38 61.59,24.51 61.72,24.64 63.06,24.64 63.18,24.77 63.18,24.89 63.06,25.02 62.8,25.02 62.65,25.17 62.65,27.49 v63.05,27.89 62.17,28.78 62.17,30.54 62.36,30.73 62.74,30.73 62.86,30.86 62.86,30.99 62.74,31.11 61.98,31.11 61.85,31.24 61.85,31.37 61.98,31.5 63.25,31.5 63.37,31.62 63.37,31.75 63.25,31.88 62.86,31.88 62.65,32.09 62.65,33.59 v62.25,33.99
  Bottom 0.127: v45.45,26.29 45.85,26.69 46.45,26.69 46.81,27.05 47.24,27.05 48.01,27.81 48.26,27.81 49.28,28.83 58.42,28.83 58.93,28.32 62.62,28.32 v63.05,27.89
CASN  (via drill 0.25)
  Top 0.127: v59.85,33.99 U2.K3 | U1.U3 v46.25,31.89 | v59.05,23.89 U3.K3
  Route3 0.127: v59.05,23.89 58.78,23.89 58.36,24.32 58.36,24.89 58.23,25.02 57.97,25.02 57.85,25.14 57.85,25.91 57.97,26.03 58.23,26.03 58.36,26.16 58.36,26.42 58.23,26.54 57.97,26.54 57.85,26.67 57.85,27.43 57.97,27.56 58.23,27.56 58.36,27.69 58.36,28.38 58.17,28.58 55.12,28.58 54.99,28.7 54.99,29.59 55.12,29.72 57.91,29.72 58.42,30.23 58.42,30.62 v58.25,30.79 58.74,31.28 58.74,31.56 58.61,31.69 58.17,31.69 57.59,31.11 54.1,31.11 53.05,32.17 53.05,32.6 54.04,33.59 59.45,33.59 v59.85,33.99
  Route14 0.127: v46.25,31.89 48.12,31.89 48.83,31.18 50.86,31.18 50.99,31.05 50.99,30.73 51.12,30.61 51.25,30.61 51.37,30.73 51.37,31.05 51.5,31.18 51.63,31.18 51.75,31.05 51.75,30.73 51.88,30.61 52.01,30.61 52.13,30.73 52.13,31.05 52.26,31.18 52.39,31.18 52.51,31.05 52.51,30.73 52.64,30.61 58.06,30.61 v58.25,30.79
CKE  (via drill 0.25, 0.25 pad 0.46)
  Top 0.127: v60.65,37.99 U2.K9 | U1.N3 v46.25,28.69 | v60.65,27.09 U3.K9
  Route3 0.127: v60.65,27.09 60.25,26.69 60.25,25.14 60.15,25.04 59.83,25.04 59.72,24.94 59.72,24.74 59.83,24.64 60.15,24.64 60.25,24.54 60.25,23.89 60.45,23.69 60.85,23.69 61.05,23.89 61.05,29.09 60.85,29.29 60.45,29.29 60.25,29.09 60.25,28.09 60.05,27.89 v59.85,27.89 59.75,27.99 59.75,30.29 60.25,30.79 60.25,34.49 60.07,34.67 57.66,34.67 57.53,34.8 57.53,35.05 57.66,35.18 60.07,35.18 60.25,35.36 60.25,37.59 v60.65,37.99
  Route14 0.127: v46.25,28.69 46.39,28.83 58.42,28.83 59.36,27.89 v59.85,27.89
CLK  (via drill 0.25)
  Top 0.114: v59.18,35.75 59.56,36.13 59.56,36.7 59.47,36.79 U2.J7 | R9.1 50.93,33.02 v51.37,33.02 51.44,33.02 51.56,32.89 51.56,31.56 51.82,31.3 52.45,31.3 52.58,31.18 52.58,29.72 52.83,29.46 53.34,29.46 53.59,29.72 53.59,31.18 53.72,31.3 53.97,31.3 54.1,31.18 54.1,28.58 54.36,28.32 54.86,28.32 55.12,28.58 55.12,30.73 55.25,30.86 55.5,30.86 55.63,30.73 55.63,28.83 55.88,28.58 56.39,28.58 56.64,28.83 56.64,30.73 56.77,30.86 57.02,30.86 57.15,30.73 57.15,28.58 v56.71,28.13 | v59.85,25.49 59.85,25.74 59.7,25.89 U3.J7
  Bottom 0.114: v59.18,35.75 59.63,35.31 60.58,35.31 60.83,35.56 60.83,36.07 60.96,36.19 61.47,36.19 61.59,36.07 61.59,34.92 61.47,34.8 58.29,34.8 58.04,34.54 58.04,32.77 57.91,32.64 57.66,32.64 57.53,32.77 57.53,33.78 57.28,34.04 54.36,34.04 54.23,34.16 54.23,35.31 53.97,35.56 53.47,35.56 53.21,35.31 53.21,34.8 53.09,34.67 52.83,34.67 52.7,34.8 52.7,35.31 52.45,35.56 51.94,35.56 51.69,35.31 51.69,34.8 51.56,34.67 51.31,34.67 51.18,34.8 51.18,35.05 50.93,35.31 50.17,35.31 49.91,35.05 49.91,33.66 50.17,33.4 50.99,33.4 v51.37,33.02 | v56.71,28.13 57.15,27.69 58.29,27.69 59.41,26.57 59.41,26.14 59.85,25.7 v59.85,25.49
CLK125  (via drill 0.25, 0.3)
  Top 0.127: U1.D13 v38.25,21.49
  Top 0.508: v57.78,14.22 R25.1
  Route3 0.127: v38.25,21.49 38.25,21.69 38.65,22.09 38.65,22.59 38.85,22.79 43.15,22.79 43.45,22.49 43.45,22.09 43.65,21.89 44.05,21.89 44.25,21.69 44.25,21.29 44.45,21.09 44.85,21.09 45.05,20.89 45.05,19.97 48.77,16.26 51.05,16.26 53.53,13.78 57.34,13.78 v57.78,14.22
CLKN  (via drill 0.25)
  Top 0.114: v59.82,35.75 59.82,36.58 60.03,36.79 U2.K7 | R10.1 50.99,33.59 51.31,33.59 v51.37,33.66 51.82,33.21 51.82,31.69 51.94,31.56 52.58,31.56 52.83,31.3 52.83,29.84 52.96,29.72 53.21,29.72 53.34,29.84 53.34,31.3 53.59,31.56 54.1,31.56 54.36,31.3 54.36,28.7 54.48,28.58 54.74,28.58 54.86,28.7 54.86,30.86 55.12,31.11 55.63,31.11 55.88,30.86 55.88,28.96 56.01,28.83 56.26,28.83 56.39,28.96 56.39,30.86 56.64,31.11 57.15,31.11 57.4,30.86 57.4,28.19 v57.34,28.13 | v59.85,26.29 U3.K7